# Altium project SC941C.PrjPcb (part 2 of 2)

## Sheet SC941C_STORRM1.SchDoc: Sorties TOR Relais Monostable 1/2
size 393 x 270 mm; CompanyName: Seccom; Address1: 521, rue du capt. François Garbit; Address2: 69440 Mornant; Address3: seccom@seccom.fr; Address4: www.seccom.fr; DocumentNumber: 5; SheetNumber: 5; SheetTotal: 9; PageSetup: Record=PageOptions|CenterHorizontal=True|CenterVertical=True|PrintScale=0.74|XCorrection=1.00|YCorrection=1.00|PrintKind=0|BorderSize=5000000|LeftOffset=0|BottomOffset=0|Orientation=2|PaperLength=1000|PaperWidth=1000|Scale=100|PaperSource=7|PrintQuality=-4|MediaType=1|DitherType=10|PaperKind=A4|PrintScaleMode=1
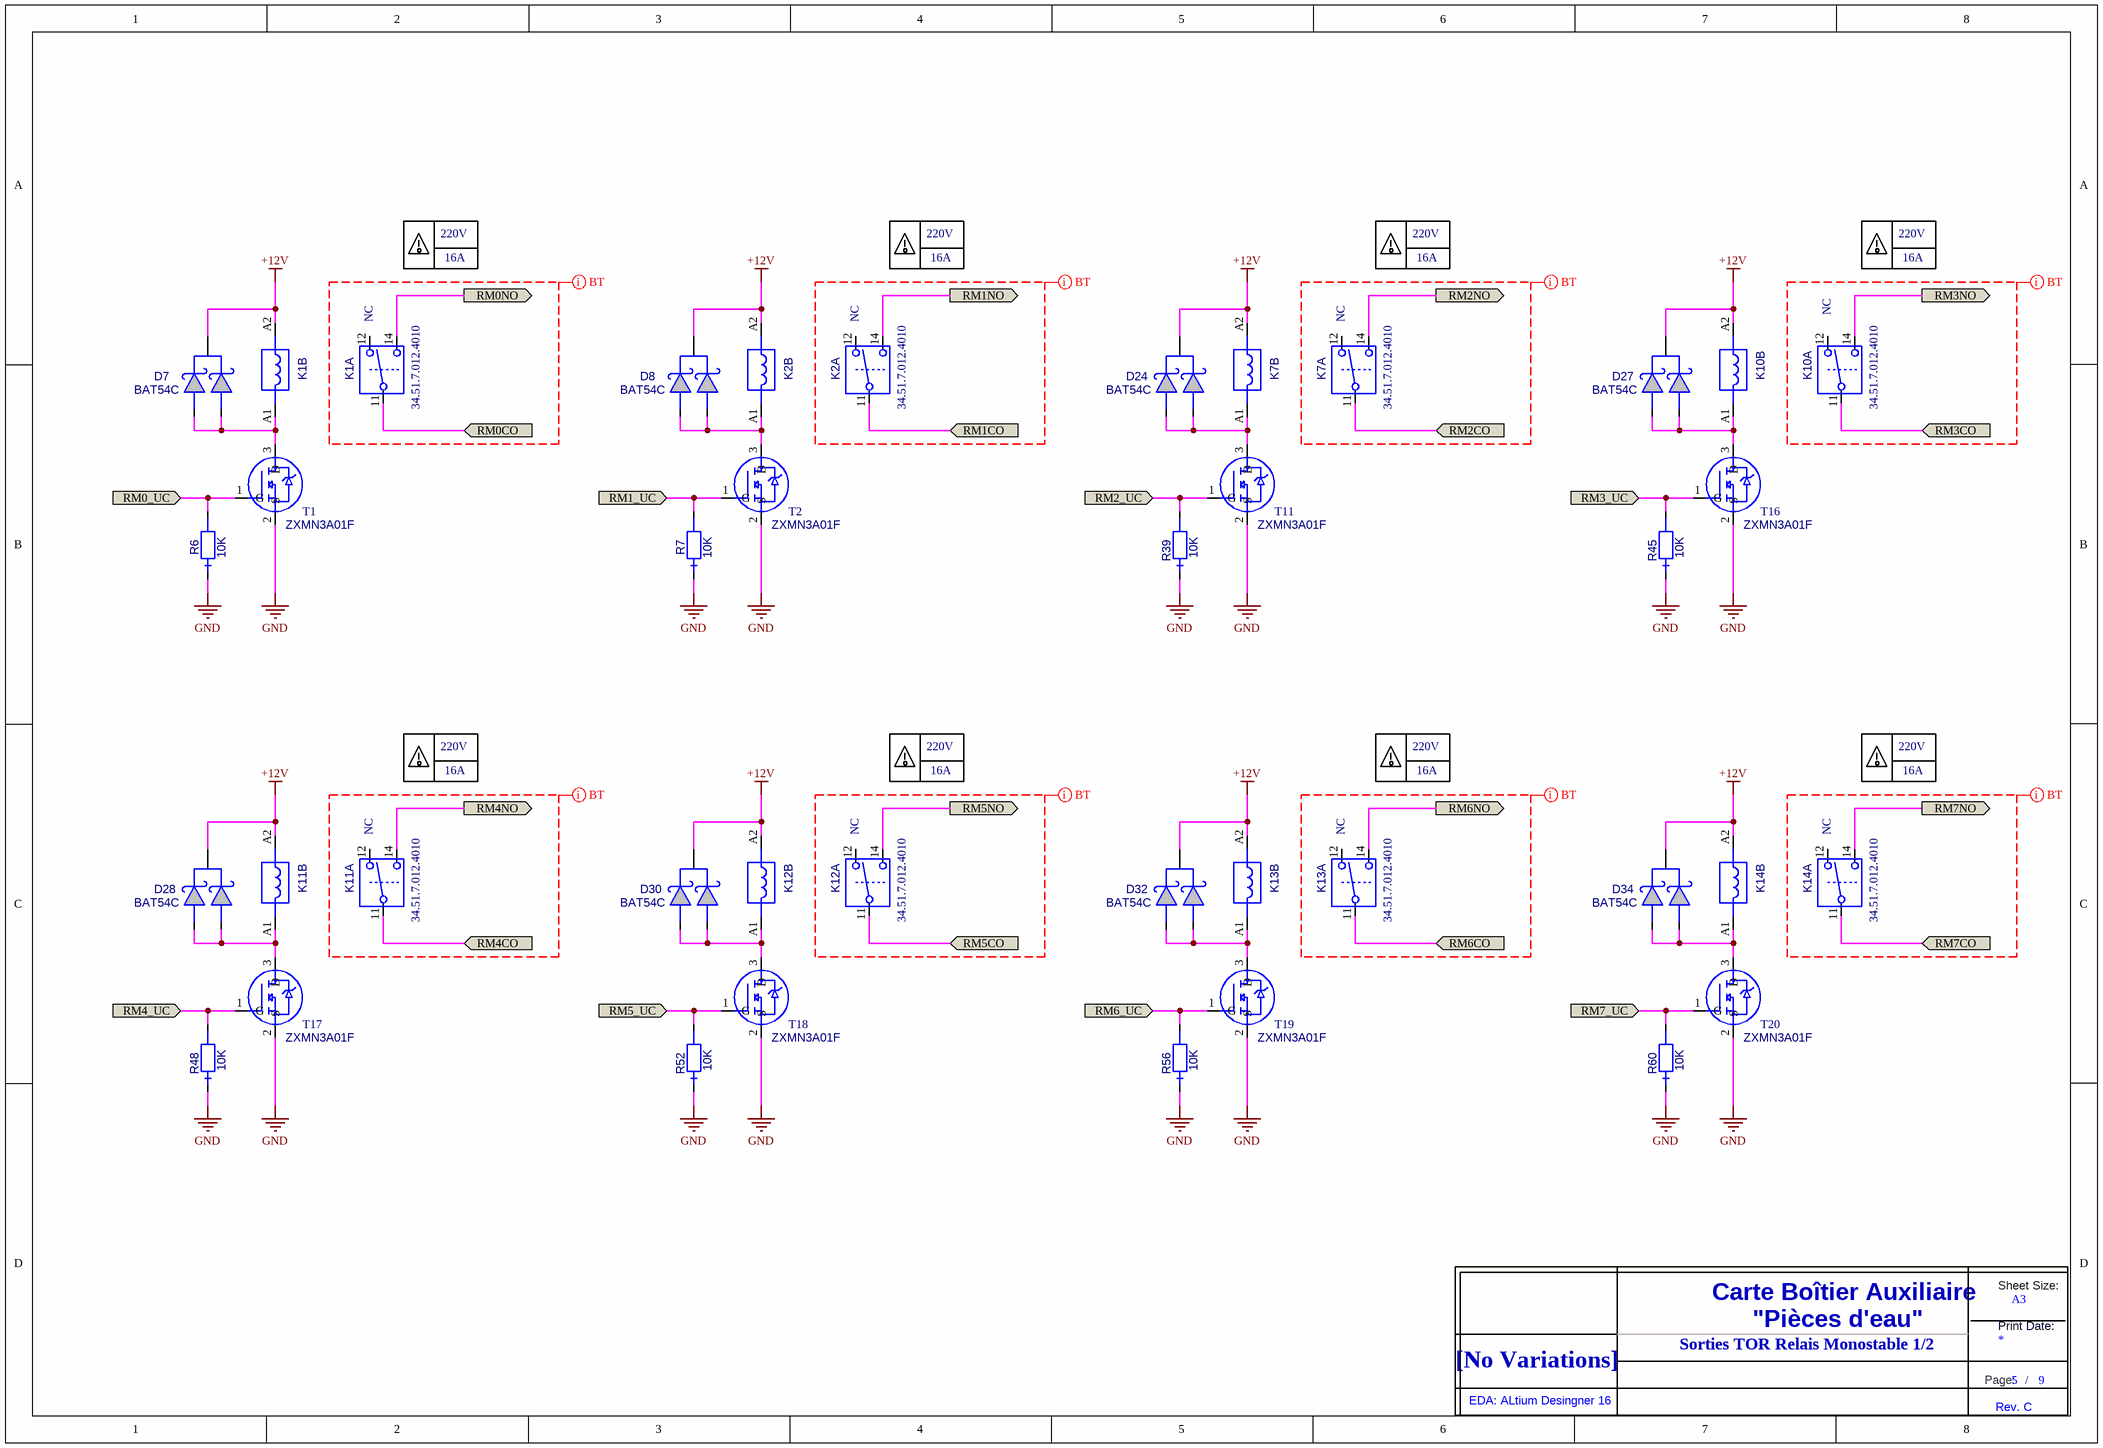
[diagram p5: SC941C_STORRM1.SchDoc]

### Parts
(Parts that share a designator on the sheet are numbered #1, #2 ... from top to bottom, then left to right.)
D7  BAT54C  [SOT23_3L_ReflowSoldering]
D8  BAT54C  [SOT23_3L_ReflowSoldering]
D24  BAT54C  [SOT23_3L_ReflowSoldering]
D27  BAT54C  [SOT23_3L_ReflowSoldering]
D28  BAT54C  [SOT23_3L_ReflowSoldering]
D30  BAT54C  [SOT23_3L_ReflowSoldering]
D32  BAT54C  [SOT23_3L_ReflowSoldering]
D34  BAT54C  [SOT23_3L_ReflowSoldering]
K1  RELAY_12VDC_1RT_34.51  [RELAY_FINDER_34.51_+SUPPORT_93]  (value not drawn)  (parts A,B of 2)
K2  RELAY_12VDC_1RT_34.51  [RELAY_FINDER_34.51_+SUPPORT_93]  (value not drawn)  (parts A,B of 2)
K7  RELAY_12VDC_1RT_34.51  [RELAY_FINDER_34.51_+SUPPORT_93]  (value not drawn)  (parts A,B of 2)
K10  RELAY_12VDC_1RT_34.51  [RELAY_FINDER_34.51_+SUPPORT_93]  (value not drawn)  (parts A,B of 2)
K11  RELAY_12VDC_1RT_34.51  [RELAY_FINDER_34.51_+SUPPORT_93]  (value not drawn)  (parts A,B of 2)
K12  RELAY_12VDC_1RT_34.51  [RELAY_FINDER_34.51_+SUPPORT_93]  (value not drawn)  (parts A,B of 2)
K13  RELAY_12VDC_1RT_34.51  [RELAY_FINDER_34.51_+SUPPORT_93]  (value not drawn)  (parts A,B of 2)
K14  RELAY_12VDC_1RT_34.51  [RELAY_FINDER_34.51_+SUPPORT_93]  (value not drawn)  (parts A,B of 2)
R6  value 10K  [0805_ReflowSoldering_RES]  (hidden comment: RES_0805_1%_100PPM_10K)
R7  value 10K  [0805_ReflowSoldering_RES]  (hidden comment: RES_0805_1%_100PPM_10K)
R39  value 10K  [0805_ReflowSoldering_RES]  (hidden comment: RES_0805_1%_100PPM_10K)
R45  value 10K  [0805_ReflowSoldering_RES]  (hidden comment: RES_0805_1%_100PPM_10K)
R48  value 10K  [0805_ReflowSoldering_RES]  (hidden comment: RES_0805_1%_100PPM_10K)
R52  value 10K  [0805_ReflowSoldering_RES]  (hidden comment: RES_0805_1%_100PPM_10K)
R56  value 10K  [0805_ReflowSoldering_RES]  (hidden comment: RES_0805_1%_100PPM_10K)
R60  value 10K  [0805_ReflowSoldering_RES]  (hidden comment: RES_0805_1%_100PPM_10K)
T1  ZXMN3A01F  [SOT23_3L_ReflowSoldering]
T2  ZXMN3A01F  [SOT23_3L_ReflowSoldering]
T11  ZXMN3A01F  [SOT23_3L_ReflowSoldering]
T16  ZXMN3A01F  [SOT23_3L_ReflowSoldering]
T17  ZXMN3A01F  [SOT23_3L_ReflowSoldering]
T18  ZXMN3A01F  [SOT23_3L_ReflowSoldering]
T19  ZXMN3A01F  [SOT23_3L_ReflowSoldering]
T20  ZXMN3A01F  [SOT23_3L_ReflowSoldering]
Title_new#5  DNI  (value not drawn)  (graphical)

### Ports
RM0_UC (in), RM0CO (in), RM0NO (out), RM1_UC (in), RM1CO (in), RM1NO (out), RM2_UC (in), RM2CO (in), RM2NO (out), RM3_UC (in), RM3CO (in), RM3NO (out), RM4_UC (in), RM4CO (in), RM4NO (out), RM5_UC (in), RM5CO (in), RM5NO (out), RM6_UC (in), RM6CO (in), RM6NO (out), RM7_UC (in), RM7CO (in), RM7NO (out)

### Nets
+12V: D7.3 D8.3 D24.3 D27.3 D28.3 D30.3 D32.3 D34.3 K1.A2 K2.A2 K7.A2 K10.A2 K11.A2 K12.A2 K13.A2 K14.A2
GND: R6.1 R7.1 R39.1 R45.1 R48.1 R52.1 R56.1 R60.1 T1.2(S) T2.2(S) T11.2(S) T16.2(S) T17.2(S) T18.2(S) T19.2(S) T20.2(S)
RM0_UC: R6.2 T1.1(G) ; port RM0_UC
RM0CO: K1.11(COM) K2.11(COM) ; port RM0CO, port RM1CO
RM0NO: K1.14(NO) ; port RM0NO
RM1_UC: R7.2 T2.1(G) ; port RM1_UC
RM1NO: K2.14(NO) ; port RM1NO
RM2_UC: R39.2 T11.1(G) ; port RM2_UC
RM2CO: K7.11(COM) ; port RM2CO
RM2NO: K7.14(NO) ; port RM2NO
RM3_UC: R45.2 T16.1(G) ; port RM3_UC
RM3CO: K10.11(COM) K11.11(COM) ; port RM4CO, port RM3CO
RM3NO: K10.14(NO) ; port RM3NO
RM4_UC: R48.2 T17.1(G) ; port RM4_UC
RM4NO: K11.14(NO) ; port RM4NO
RM5_UC: R52.2 T18.1(G) ; port RM5_UC
RM5CO: K12.11(COM) ; port RM5CO
RM5NO: K12.14(NO) ; port RM5NO
RM6_UC: R56.2 T19.1(G) ; port RM6_UC
RM6CO: K13.11(COM) ; port RM6CO
RM6NO: K13.14(NO) ; port RM6NO
RM7_UC: R60.2 T20.1(G) ; port RM7_UC
RM7CO: K14.11(COM) ; port RM7CO
RM7NO: K14.14(NO) ; port RM7NO
NetD7_1: D7.1 D7.2 K1.A1 T1.3(D)
NetD8_1: D8.1 D8.2 K2.A1 T2.3(D)
NetD24_1: D24.1 D24.2 K7.A1 T11.3(D)
NetD27_1: D27.1 D27.2 K10.A1 T16.3(D)
NetD28_1: D28.1 D28.2 K11.A1 T17.3(D)
NetD30_1: D30.1 D30.2 K12.A1 T18.3(D)
NetD32_1: D32.1 D32.2 K13.A1 T19.3(D)
NetD34_1: D34.1 D34.2 K14.A1 T20.3(D)

Not connected (* = marked no-connect by the designer): K1 12(NC); K2 12(NC); K7 12(NC); K10 12(NC); K11 12(NC); K12 12(NC); K13 12(NC); K14 12(NC)

### Layout directives
net class BT: (no net found under the mark)

### Notes on the sheet
- 220V
- (near K1) NC
- 16A
- (near K2) NC
- (near K7) NC
- (near K10) NC
- (near K11) NC
- (near K12) NC
- (near K13) NC
- (near K14) NC
- Sorties TOR Relais Monostable 1/2
- (in symbol Title_new) Sheet Size:; Carte Boîtier Auxiliaire; A3; "Pièces d'eau"; Print Date:; [No Variations]; Page:; /; EDA: ALtium Desingner 16; Rev. C

### Library data of the parts
D7 D8 D24 D27 D28 D30 D32 D34 = BAT54C: Diode Schottky double, BAT54 cathode com, Vrrm=30V, If=300mA, Vf=0.4Vmax, CMS; Creation: LJ (14/05/02); Reference: 000597/00; Boitier: SOT23_3L; Remarque: {Remarque}; Fabricant: NXP; Coeff: 1; Verification: LJ (14/05/02); Ref Fab: BAT54C; ComponentLink1URL: o:\_Documentation\Datasheets\NXP\BAT54_series.pdf; ComponentLink2URL: o:\_Documentation\Datasheets\_BOITIERS\ACTIF_CMS\SOT\SOT_23_3P_(Schneider).PDF; Config: *; ComponentLink1Description: Datasheet; ComponentLink2Description: Datasheet Boitier; Value: BAT54C; Supplier 1: Farnell; Supplier Part Number 1: 1081192
K1 K2 K7 K10-K14 = RELAY_12VDC_1RT_34.51: Relais 1RT, 12Vdc, série 34.51, Rc=1940R, Sw:250Vac/6A, Ron=? (AgSnO2); Creation: CHD; Verification: LJ (24/11/11); Boitier: DIP12 Form C; Remarque: {Remarque}; Fabricant: Finder; Ref Fab: 34.51.7.012.4010; Coeff: 1; Value: 34.51.7.012.4010; ComponentLink1URL: o:\_Documentation\Datasheets\Finder\Relais_Serie_34.pdf; ComponentLink2URL: o:\_Documentation\Datasheets\_BOITIERS\; Config: *; ComponentLink1Description: Datasheet; ComponentLink2Description: Datasheet Boitier
R6 R7 R39 R45 R48 R52 R56 R60 = RES_0805_1%_100PPM_10K: Résistance CMS 0805, 0.125W, 1%, 100ppm, 150V; Creation: LJ (06/02/09); Reference: 000063/00; Boitier: 0805; Remarque: {Remarque}; Fabricant: Yageo; Ref Fab: RC0805FR-0710KL; Coeff: 1; Verification: *; ComponentLink1URL: o:\_Documentation\Datasheets\BC_Components\Resistances_ThickFilmFlatChip_0402-0603-0805-1206.pdf; ComponentLink2URL: o:\_Documentation\Datasheets\_BOITIERS\PASSIF_CMS\RC_0805_(2x1,25)_(Schneider).PDF; Config: *; ComponentLink1Description: Datasheet; ComponentLink2Description: Datasheet Boitier; Supplier 1: Farnell; Supplier Part Number 1: 9237755
T1 T2 T11 T16-T20 = ZXMN3A01F: Transistor MOSN logique, Vdss=30V, Id=2A, Rdson=0.12R, CMS; Boitier: SOT23_3L; Remarque: {Remarque}; Creation: CHD; Fabricant: Zetex; Coeff: 1; Ref Fab: ZXMN3A01F; ComponentLink1URL: o:\_Documentation\Datasheets\; ComponentLink2URL: o:\_Documentation\Datasheets\_BOITIERS\ACTIF_CMS\SOT\SOT_23_3P_(Schneider).PDF; Config: *; ComponentLink1Description: Datasheet; Value: ZXMN3A01F; Supplier 1: Farnell; Supplier 2: Mouser; Supplier Part Number 1: 9525734; Supplier Part Number 2: 522-ZXMN3A01FTA
Title_new#5 = Title_new

## Sheet SC941C_STORRM2.SchDoc: Sorties TOR Relais Monostable 2/2
size 393 x 270 mm; CompanyName: Seccom; Address1: 521, rue du capt. François Garbit; Address2: 69440 Mornant; Address3: seccom@seccom.fr; Address4: www.seccom.fr; DocumentNumber: 6; SheetNumber: 6; SheetTotal: 9; PageSetup: Record=PageOptions|CenterHorizontal=True|CenterVertical=True|PrintScale=0.74|XCorrection=1.00|YCorrection=1.00|PrintKind=0|BorderSize=5000000|LeftOffset=0|BottomOffset=0|Orientation=2|PaperLength=1000|PaperWidth=1000|Scale=100|PaperSource=7|PrintQuality=-4|MediaType=1|DitherType=10|PaperKind=A4|PrintScaleMode=1
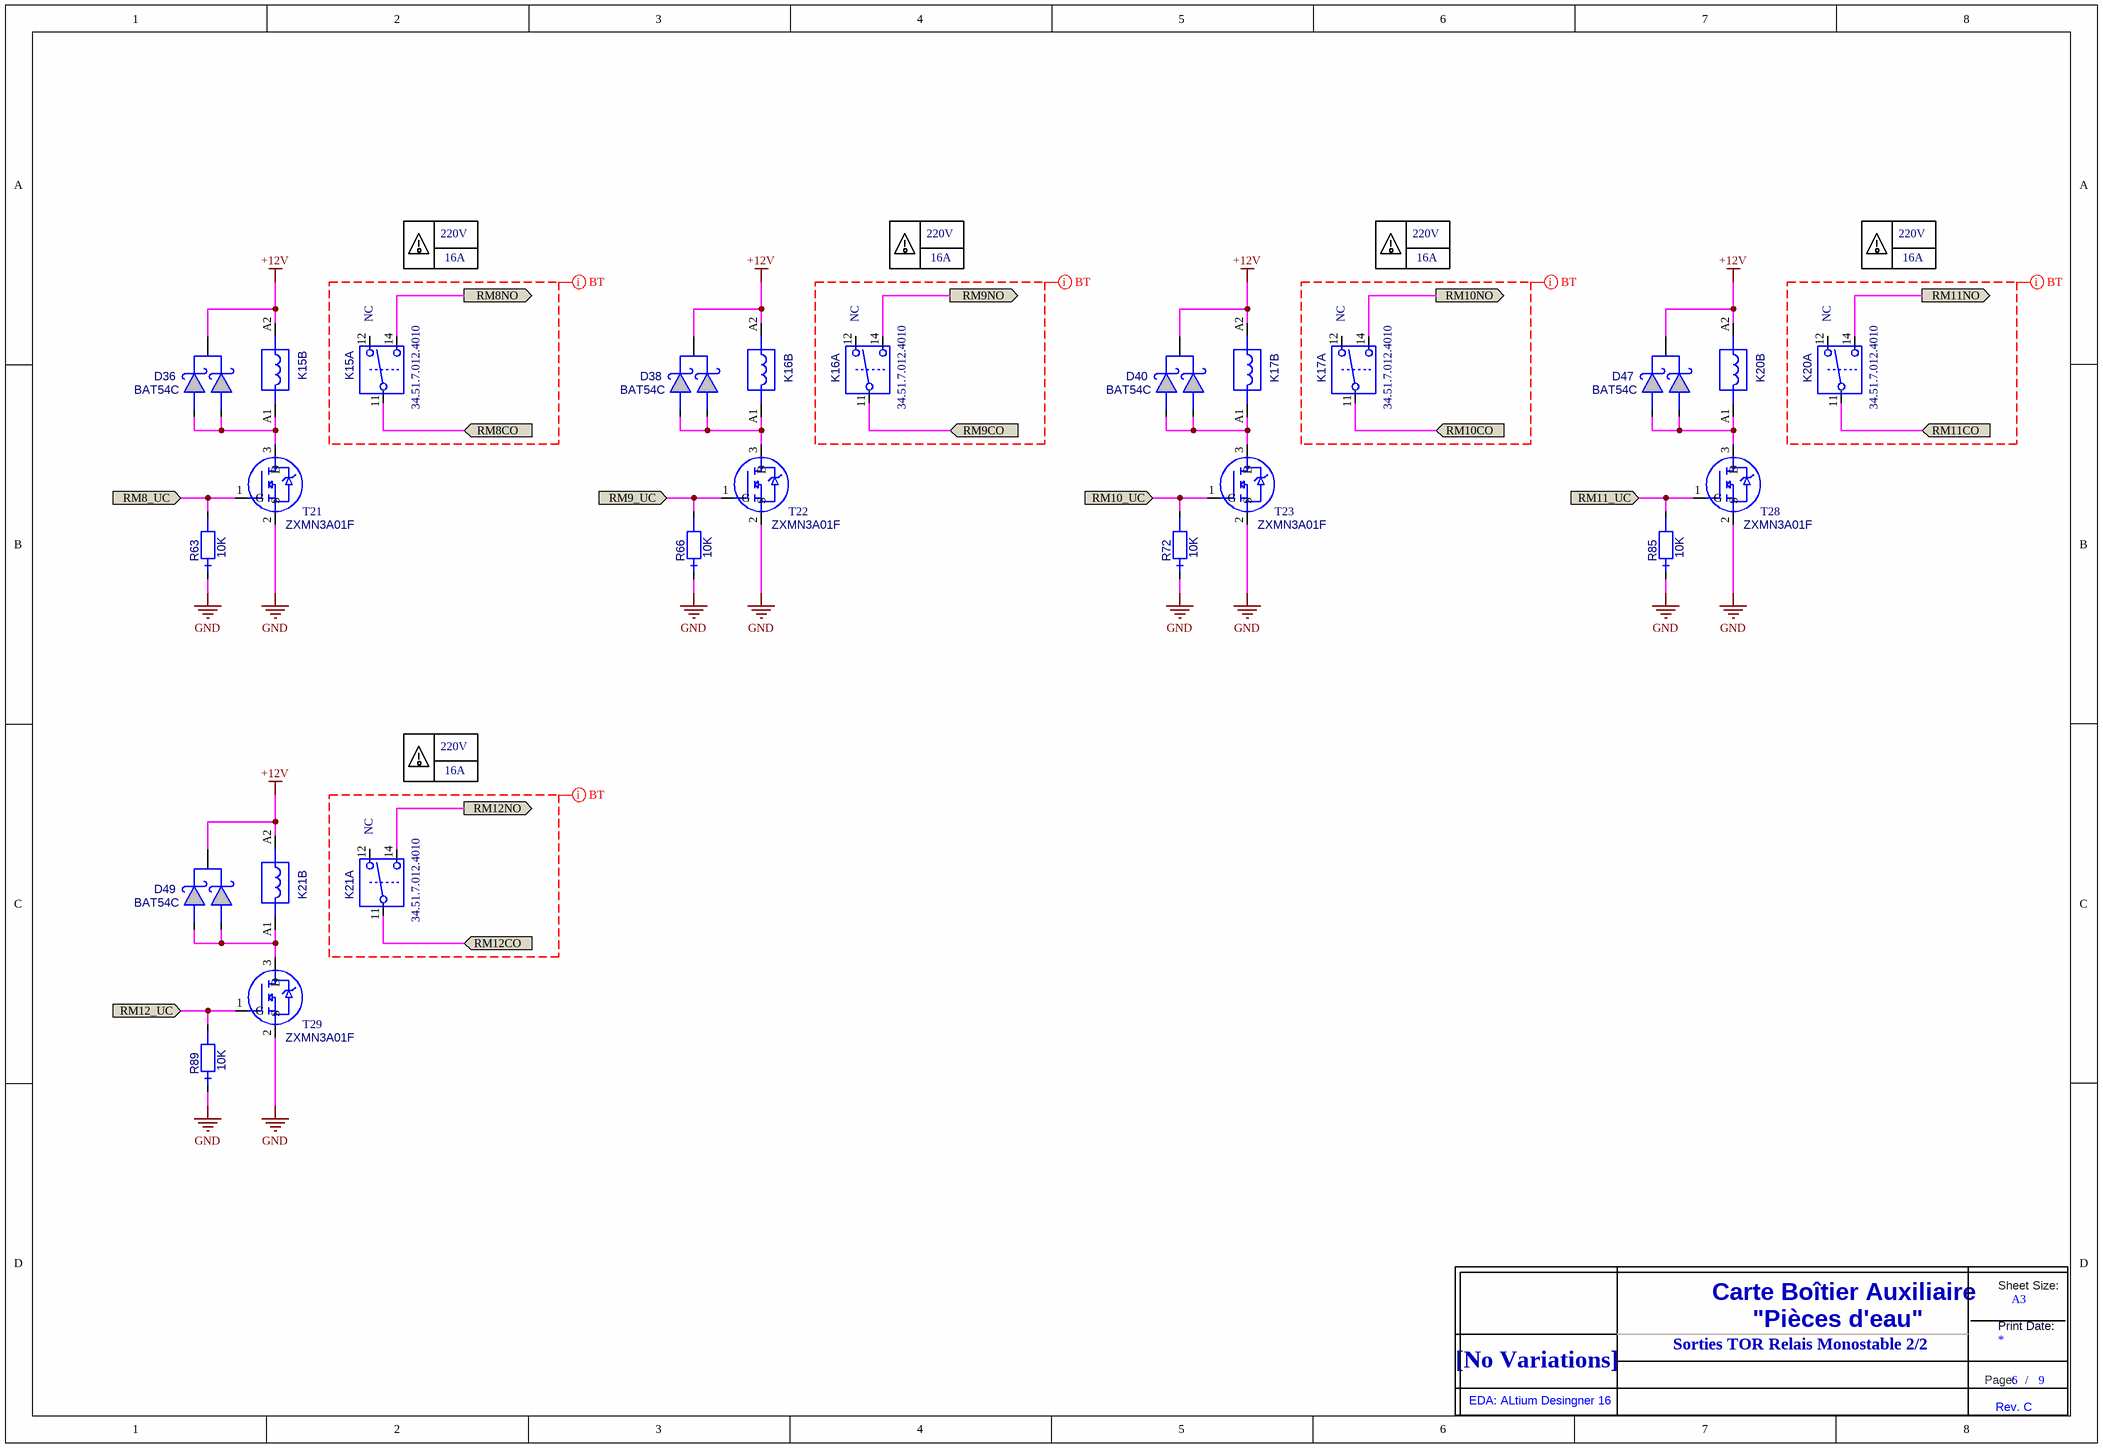
[diagram p6: SC941C_STORRM2.SchDoc]

### Parts
(Parts that share a designator on the sheet are numbered #1, #2 ... from top to bottom, then left to right.)
D36  BAT54C  [SOT23_3L_ReflowSoldering]
D38  BAT54C  [SOT23_3L_ReflowSoldering]
D40  BAT54C  [SOT23_3L_ReflowSoldering]
D47  BAT54C  [SOT23_3L_ReflowSoldering]
D49  BAT54C  [SOT23_3L_ReflowSoldering]
K15  RELAY_12VDC_1RT_34.51  [RELAY_FINDER_34.51_+SUPPORT_93]  (value not drawn)  (parts A,B of 2)
K16  RELAY_12VDC_1RT_34.51  [RELAY_FINDER_34.51_+SUPPORT_93]  (value not drawn)  (parts A,B of 2)
K17  RELAY_12VDC_1RT_34.51  [RELAY_FINDER_34.51_+SUPPORT_93]  (value not drawn)  (parts A,B of 2)
K20  RELAY_12VDC_1RT_34.51  [RELAY_FINDER_34.51_+SUPPORT_93]  (value not drawn)  (parts A,B of 2)
K21  RELAY_12VDC_1RT_34.51  [RELAY_FINDER_34.51_+SUPPORT_93]  (value not drawn)  (parts A,B of 2)
R63  value 10K  [0805_ReflowSoldering_RES]  (hidden comment: RES_0805_1%_100PPM_10K)
R66  value 10K  [0805_ReflowSoldering_RES]  (hidden comment: RES_0805_1%_100PPM_10K)
R72  value 10K  [0805_ReflowSoldering_RES]  (hidden comment: RES_0805_1%_100PPM_10K)
R85  value 10K  [0805_ReflowSoldering_RES]  (hidden comment: RES_0805_1%_100PPM_10K)
R89  value 10K  [0805_ReflowSoldering_RES]  (hidden comment: RES_0805_1%_100PPM_10K)
T21  ZXMN3A01F  [SOT23_3L_ReflowSoldering]
T22  ZXMN3A01F  [SOT23_3L_ReflowSoldering]
T23  ZXMN3A01F  [SOT23_3L_ReflowSoldering]
T28  ZXMN3A01F  [SOT23_3L_ReflowSoldering]
T29  ZXMN3A01F  [SOT23_3L_ReflowSoldering]
Title_new#6  DNI  (value not drawn)  (graphical)

### Ports
RM8_UC (in), RM8CO (in), RM8NO (out), RM9_UC (in), RM9CO (in), RM9NO (out), RM10_UC (in), RM10CO (in), RM10NO (out), RM11_UC (in), RM11CO (in), RM11NO (out), RM12_UC (in), RM12CO (in), RM12NO (out)

### Nets
+12V: D36.3 D38.3 D40.3 D47.3 D49.3 K15.A2 K16.A2 K17.A2 K20.A2 K21.A2
GND: R63.1 R66.1 R72.1 R85.1 R89.1 T21.2(S) T22.2(S) T23.2(S) T28.2(S) T29.2(S)
RM8_UC: R63.2 T21.1(G) ; port RM8_UC
RM8CO: K15.11(COM) ; port RM8CO
RM8NO: K15.14(NO) ; port RM8NO
RM9_UC: R66.2 T22.1(G) ; port RM9_UC
RM9CO: K16.11(COM) ; port RM9CO
RM9NO: K16.14(NO) ; port RM9NO
RM10_UC: R72.2 T23.1(G) ; port RM10_UC
RM10CO: K17.11(COM) ; port RM10CO
RM10NO: K17.14(NO) ; port RM10NO
RM11_UC: R85.2 T28.1(G) ; port RM11_UC
RM11CO: K20.11(COM) K21.11(COM) ; port RM12CO, port RM11CO
RM11NO: K20.14(NO) ; port RM11NO
RM12_UC: R89.2 T29.1(G) ; port RM12_UC
RM12NO: K21.14(NO) ; port RM12NO
NetD36_1: D36.1 D36.2 K15.A1 T21.3(D)
NetD38_1: D38.1 D38.2 K16.A1 T22.3(D)
NetD40_1: D40.1 D40.2 K17.A1 T23.3(D)
NetD47_1: D47.1 D47.2 K20.A1 T28.3(D)
NetD49_1: D49.1 D49.2 K21.A1 T29.3(D)

Not connected (* = marked no-connect by the designer): K15 12(NC); K16 12(NC); K17 12(NC); K20 12(NC); K21 12(NC)

### Layout directives
net class BT: (no net found under the mark)

### Notes on the sheet
- 220V
- (near K15) NC
- 16A
- (near K16) NC
- (near K17) NC
- (near K20) NC
- (near K21) NC
- Sorties TOR Relais Monostable 2/2
- (in symbol Title_new) Sheet Size:; Carte Boîtier Auxiliaire; A3; "Pièces d'eau"; Print Date:; [No Variations]; Page:; /; EDA: ALtium Desingner 16; Rev. C

### Library data of the parts
D36 D38 D40 D47 D49 = BAT54C: as D7 on sheet SC941C_STORRM1; Verification: LJ (14/05/02); Ref Fab: BAT54C; ComponentLink1URL: o:\_Documentation\Datasheets\NXP\BAT54_series.pdf; ComponentLink2URL: o:\_Documentation\Datasheets\_BOITIERS\ACTIF_CMS\SOT\SOT_23_3P_(Schneider).PDF; Config: *; ComponentLink1Description: Datasheet; ComponentLink2Description: Datasheet Boitier; Value: BAT54C; Supplier 1: Farnell; Supplier Part Number 1: 1081192
K15-K17 K20 K21 = RELAY_12VDC_1RT_34.51: as K1 on sheet SC941C_STORRM1; ComponentLink1URL: o:\_Documentation\Datasheets\Finder\Relais_Serie_34.pdf; ComponentLink2URL: o:\_Documentation\Datasheets\_BOITIERS\; Config: *; ComponentLink1Description: Datasheet; ComponentLink2Description: Datasheet Boitier
R63 R66 R72 R85 R89 = RES_0805_1%_100PPM_10K: as R6 on sheet SC941C_STORRM1; Verification: *; ComponentLink1URL: o:\_Documentation\Datasheets\BC_Components\Resistances_ThickFilmFlatChip_0402-0603-0805-1206.pdf; ComponentLink2URL: o:\_Documentation\Datasheets\_BOITIERS\PASSIF_CMS\RC_0805_(2x1,25)_(Schneider).PDF; Config: *; ComponentLink1Description: Datasheet; ComponentLink2Description: Datasheet Boitier; Supplier 1: Farnell; Supplier Part Number 1: 9237755
T21-T23 T28 T29 = ZXMN3A01F: as T1 on sheet SC941C_STORRM1; Ref Fab: ZXMN3A01F; ComponentLink1URL: o:\_Documentation\Datasheets\; ComponentLink2URL: o:\_Documentation\Datasheets\_BOITIERS\ACTIF_CMS\SOT\SOT_23_3P_(Schneider).PDF; Config: *; ComponentLink1Description: Datasheet; Value: ZXMN3A01F; Supplier 1: Farnell; Supplier 2: Mouser; Supplier Part Number 1: 9525734; Supplier Part Number 2: 522-ZXMN3A01FTA
Title_new#6 = Title_new

## Sheet SC941C_Variateurs.SchDoc: Variateurs
size 393 x 270 mm; CompanyName: Seccom; Address1: 521, rue du capt. François Garbit; Address2: 69440 Mornant; Address3: seccom@seccom.fr; Address4: www.seccom.fr; DocumentNumber: 7; SheetNumber: 7; SheetTotal: 9; PageSetup: Record=PageOptions|CenterHorizontal=True|CenterVertical=True|PrintScale=0.74|XCorrection=1.00|YCorrection=1.00|PrintKind=0|BorderSize=5000000|LeftOffset=0|BottomOffset=0|Orientation=2|PaperLength=1000|PaperWidth=1000|Scale=100|PaperSource=7|PrintQuality=-4|MediaType=1|DitherType=10|PaperKind=A4|PrintScaleMode=1
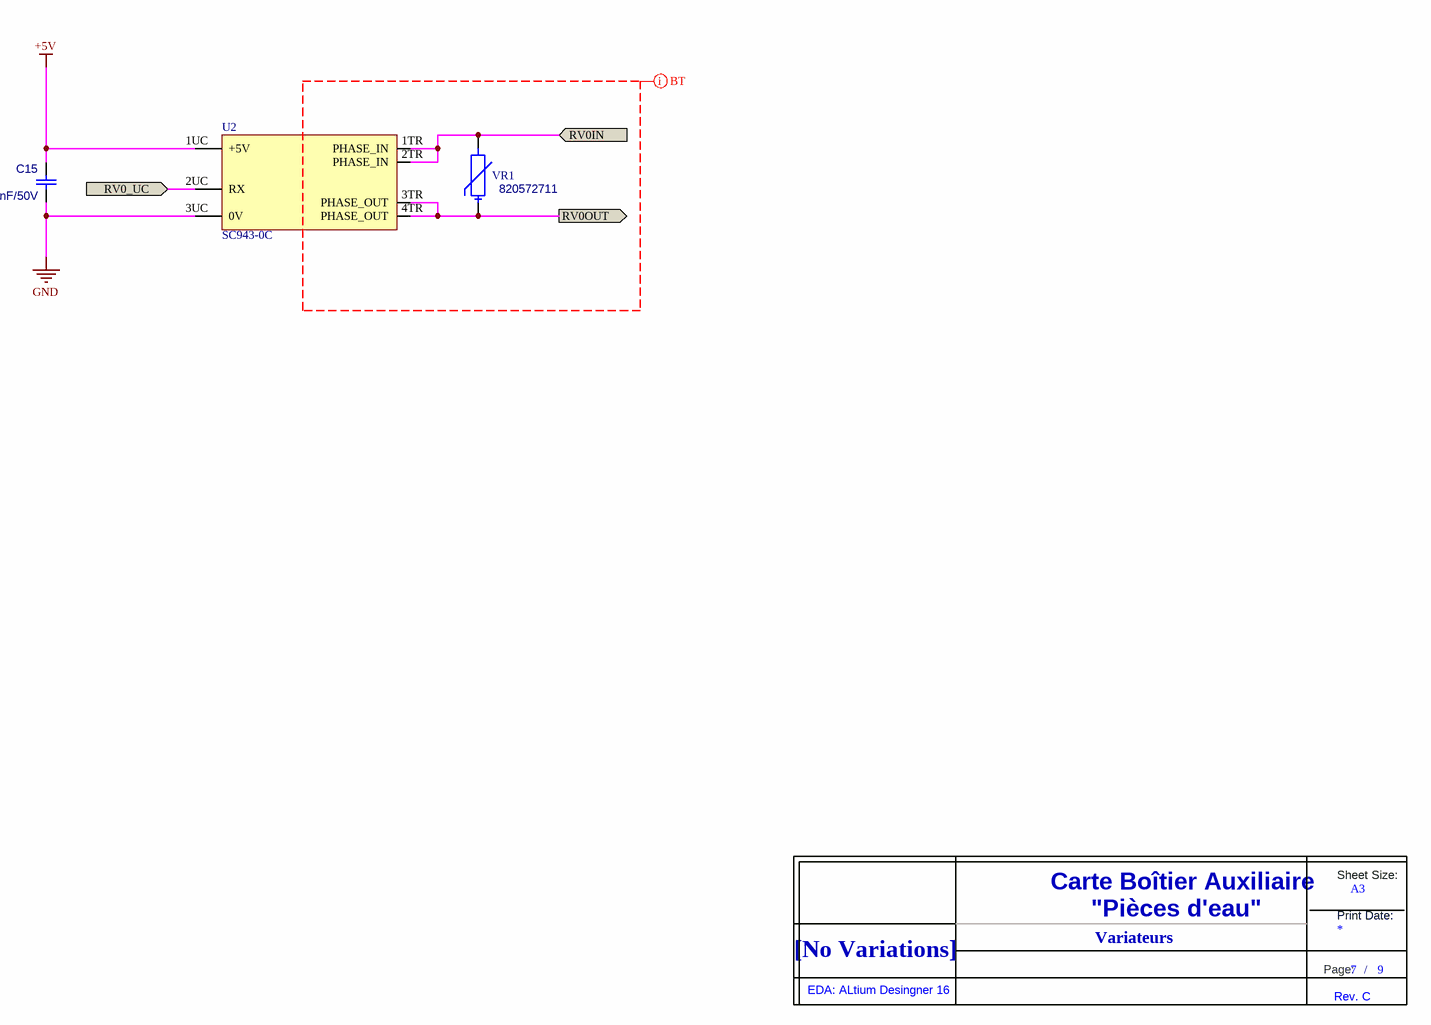
[diagram p7: SC941C_Variateurs.SchDoc]

### Parts
(Parts that share a designator on the sheet are numbered #1, #2 ... from top to bottom, then left to right.)
C15  value 100nF/50V  [0805_ReflowSoldering_CAP]  (hidden comment: C_0805_X7R_10%_100N-50V)
Title_new#7  DNI  (value not drawn)  (graphical)
U2  SC943-0C  [SI943C_REV_A]
VR1  value 820572711  [VDR_Serie_820_d7_h13_e5mm]  (hidden comment: VDR_820572711)

### Ports
RV0_UC (in), RV0IN (in), RV0OUT (out)

### Nets
+5V: C15.1 U2.1UC(+5V)
GND: C15.2 U2.3UC(0V)
RV0_UC: U2.2UC(RX) ; port RV0_UC
RV0IN: U2.1TR(PHASE_IN) U2.2TR(PHASE_IN) VR1.2 ; port RV0IN
RV0OUT: U2.3TR(PHASE_OUT) U2.4TR(PHASE_OUT) VR1.1 ; port RV0OUT

### Layout directives
net class BT: (no net found under the mark)

### Notes on the sheet
- Variateurs
- (in symbol Title_new) Sheet Size:; Carte Boîtier Auxiliaire; A3; "Pièces d'eau"; Print Date:; [No Variations]; Page:; /; EDA: ALtium Desingner 16; Rev. C

### Library data of the parts
C15 = C_0805_X7R_10%_100N-50V: Condensateur céramique, X7R, 10%, CMS 0805; Creation: LJ; Verification: LJ (28/05/04); Reference: 000042/00; Boitier: 0805; Remarque: {Remarque}; Fabricant: AVX; Ref Fab: 08055C104KAT2A; Coeff: 1; ComponentLink1URL: o:\_Documentation\Datasheets\BC_Components\Condo_CMS_NPO-X7R-Y5V.pdf; ComponentLink2URL: o:\_Documentation\Datasheets\_BOITIERS\PASSIF_CMS\RC_0805_(2x1,25)_(Schneider).PDF; Config: *; ComponentLink1Description: Datasheet; ComponentLink2Description: Datasheet Boitier; Supplier 1: Farnell; Supplier Part Number 1: 499687
Title_new#7 = Title_new
U2 = SC943-0C: Carte gradateur; Boitier: SI943C; Coeff: 1; Fabricant: Valentinéa; Remarque: {Remarque}; Ref Fab: SC943-0C; Value: SC943-0C
VR1 = VDR_820572711: Varistance disque 275Vac, 350Vdc, 33J, Vbreak=430V@1mA, Vclamp=710V@10A, Ipeak=1200A; Creation: LJ (12/01/12); Reference: {Reference}; Boitier: d7_t4.6_h13_e5mm; Remarque: {Remarque}; Fabricant: Wurth Elektronik; Coeff: 1; Ref Fab: 820572711; ComponentLink1URL: o:\_Documentation\Datasheets\Wurth_Elektronik\Varistance_820572711.pdf; ComponentLink2URL: o:\_Documentation\Datasheets\; Config: *; ComponentLink1Description: Datasheet; ComponentLink2Description: Datasheet Boitier

## Sheet SC941C_STORRB.SchDoc: Sorties TOR Relais Bistable
size 393 x 270 mm; CompanyName: Seccom; Address1: 521, rue du capt. François Garbit; Address2: 69440 Mornant; Address3: seccom@seccom.fr; Address4: www.seccom.fr; DocumentNumber: 8; SheetNumber: 8; SheetTotal: 9; PageSetup: Record=PageOptions|CenterHorizontal=True|CenterVertical=True|PrintScale=0.74|XCorrection=1.00|YCorrection=1.00|PrintKind=0|BorderSize=5000000|LeftOffset=0|BottomOffset=0|Orientation=2|PaperLength=1000|PaperWidth=1000|Scale=100|PaperSource=7|PrintQuality=-4|MediaType=1|DitherType=10|PaperKind=A4|PrintScaleMode=1
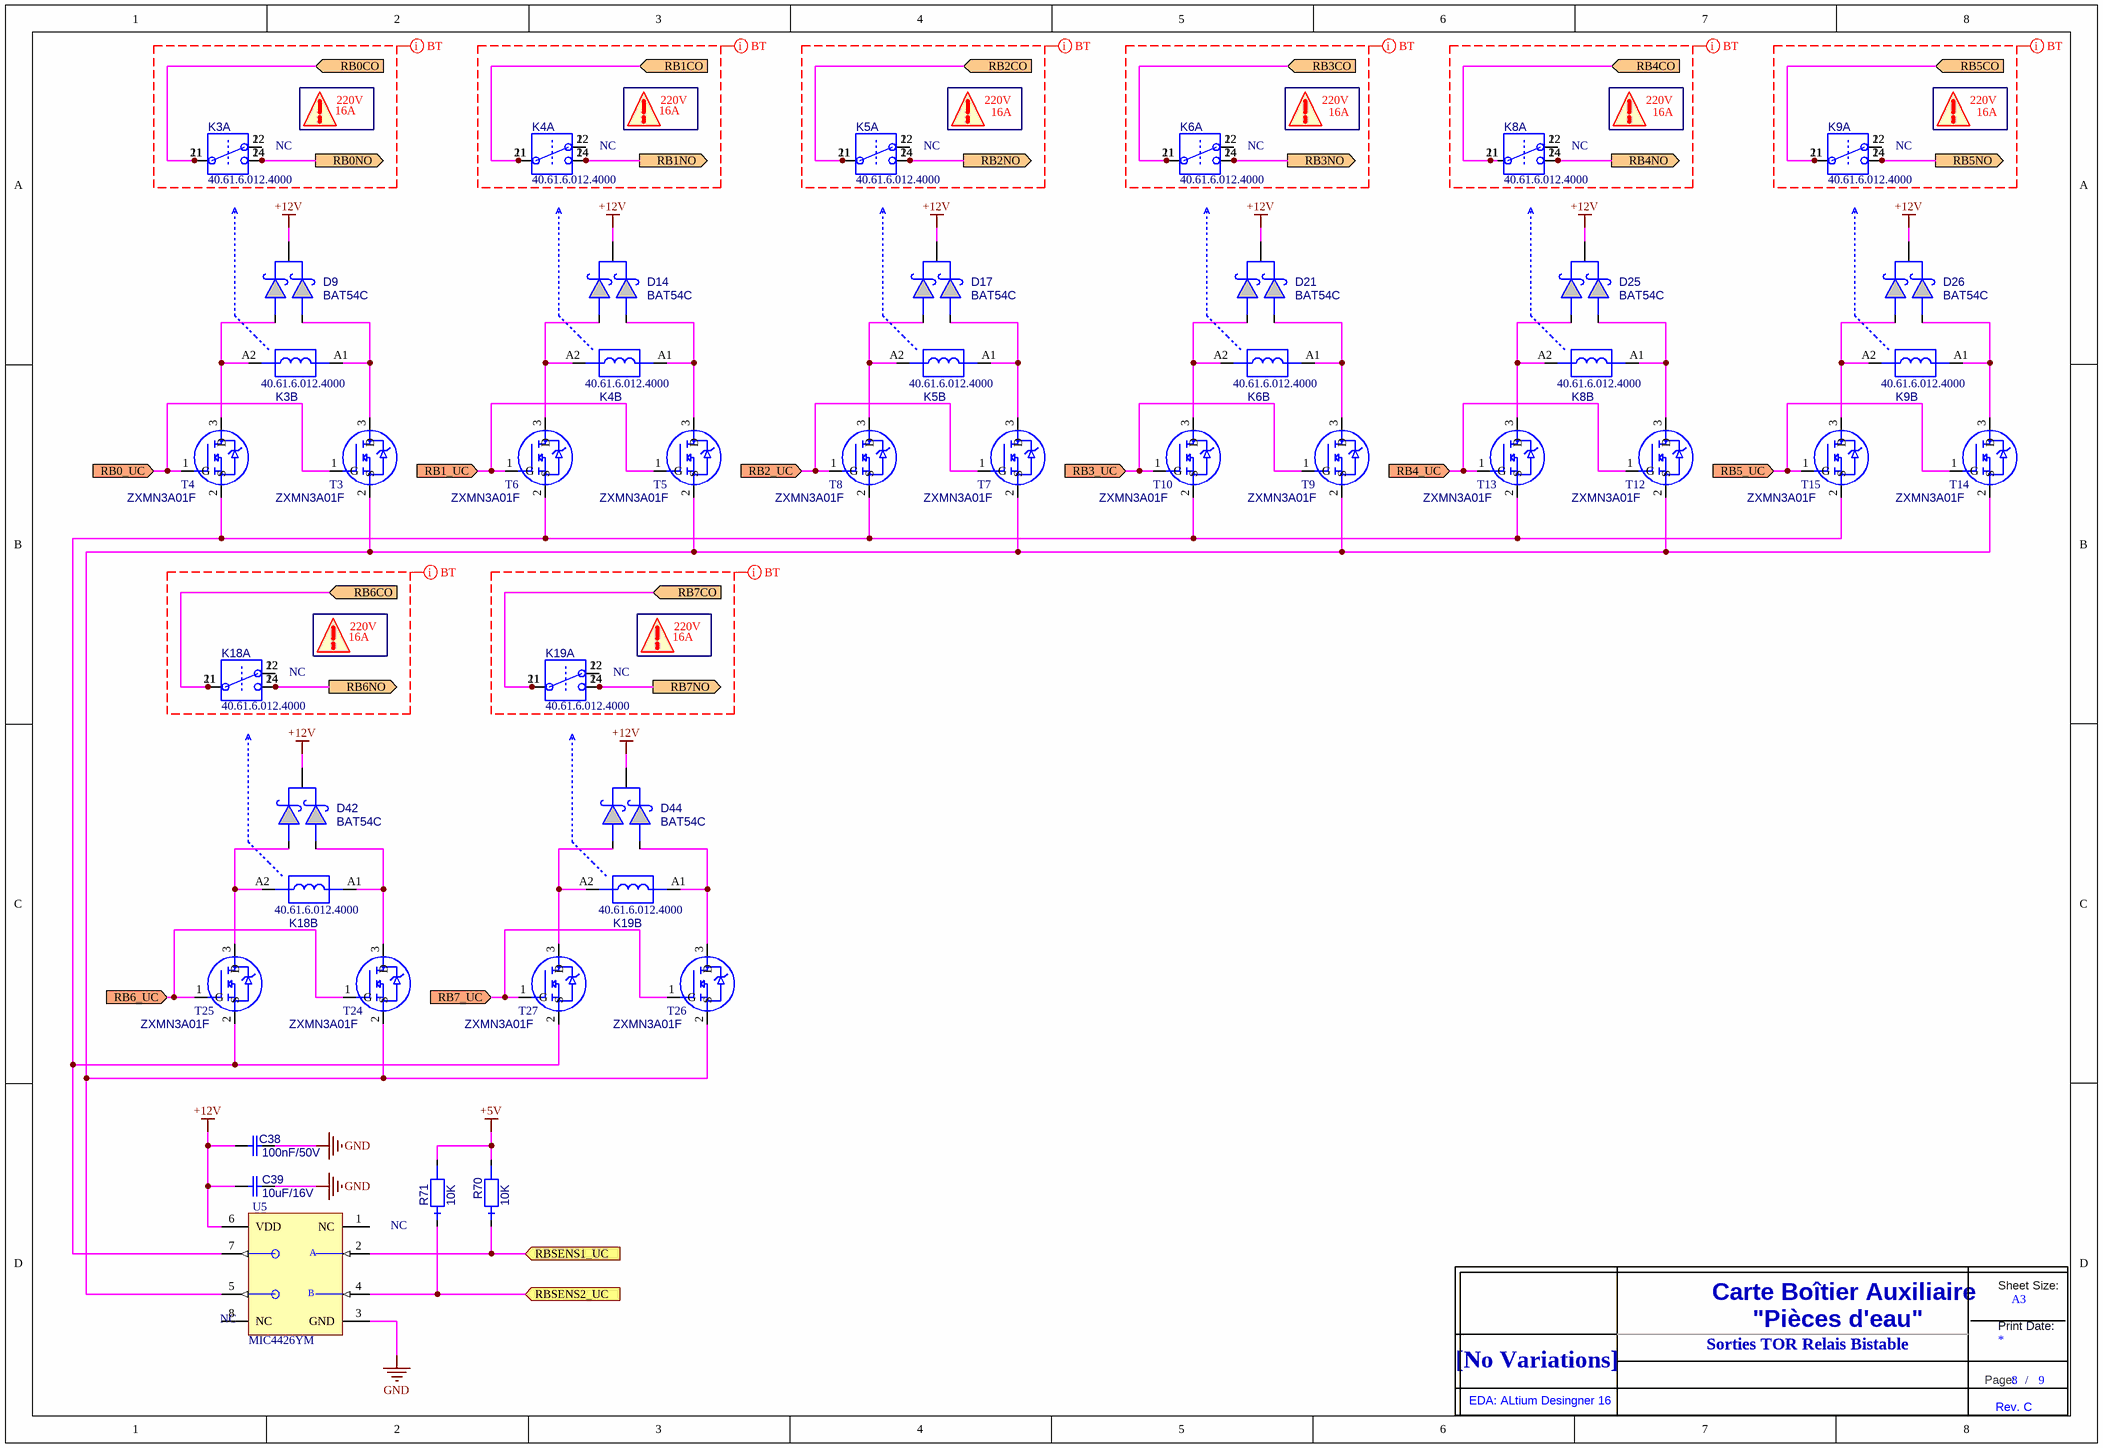
[diagram p8: SC941C_STORRB.SchDoc]

### Parts
(Parts that share a designator on the sheet are numbered #1, #2 ... from top to bottom, then left to right.)
C38  value 100nF/50V  [0805_ReflowSoldering_CAP]  (hidden comment: C_0805_X7R_10%_100N-50V)
C39  value 10uF/16V  [0805_ReflowSoldering_CAP]  (hidden comment: C_0805_X5R_10%_10U-16V)
D9  BAT54C  [SOT23_3L_ReflowSoldering]
D14  BAT54C  [SOT23_3L_ReflowSoldering]
D17  BAT54C  [SOT23_3L_ReflowSoldering]
D21  BAT54C  [SOT23_3L_ReflowSoldering]
D25  BAT54C  [SOT23_3L_ReflowSoldering]
D26  BAT54C  [SOT23_3L_ReflowSoldering]
D42  BAT54C  [SOT23_3L_ReflowSoldering]
D44  BAT54C  [SOT23_3L_ReflowSoldering]
K3  value 40.61.6.012.4000  [RELAY_FINDER_40.61_+SUPPORT_95]  (hidden comment: RELAY_12VDC_1RT_BI_40.61.6)  (parts A,B of 2)
K4  value 40.61.6.012.4000  [RELAY_FINDER_40.61_+SUPPORT_95]  (hidden comment: RELAY_12VDC_1RT_BI_40.61.6)  (parts A,B of 2)
K5  value 40.61.6.012.4000  [RELAY_FINDER_40.61_+SUPPORT_95]  (hidden comment: RELAY_12VDC_1RT_BI_40.61.6)  (parts A,B of 2)
K6  value 40.61.6.012.4000  [RELAY_FINDER_40.61_+SUPPORT_95]  (hidden comment: RELAY_12VDC_1RT_BI_40.61.6)  (parts A,B of 2)
K8  value 40.61.6.012.4000  [RELAY_FINDER_40.61_+SUPPORT_95]  (hidden comment: RELAY_12VDC_1RT_BI_40.61.6)  (parts A,B of 2)
K9  value 40.61.6.012.4000  [RELAY_FINDER_40.61_+SUPPORT_95]  (hidden comment: RELAY_12VDC_1RT_BI_40.61.6)  (parts A,B of 2)
K18  value 40.61.6.012.4000  [RELAY_FINDER_40.61_+SUPPORT_95]  (hidden comment: RELAY_12VDC_1RT_BI_40.61.6)  (parts A,B of 2)
K19  value 40.61.6.012.4000  [RELAY_FINDER_40.61_+SUPPORT_95]  (hidden comment: RELAY_12VDC_1RT_BI_40.61.6)  (parts A,B of 2)
R70  value 10K  [0805_ReflowSoldering_RES]  (hidden comment: RES_0805_1%_100PPM_10K)
R71  value 10K  [0805_ReflowSoldering_RES]  (hidden comment: RES_0805_1%_100PPM_10K)
T3  ZXMN3A01F  [SOT23_3L_ReflowSoldering]
T4  ZXMN3A01F  [SOT23_3L_ReflowSoldering]
T5  ZXMN3A01F  [SOT23_3L_ReflowSoldering]
T6  ZXMN3A01F  [SOT23_3L_ReflowSoldering]
T7  ZXMN3A01F  [SOT23_3L_ReflowSoldering]
T8  ZXMN3A01F  [SOT23_3L_ReflowSoldering]
T9  ZXMN3A01F  [SOT23_3L_ReflowSoldering]
T10  ZXMN3A01F  [SOT23_3L_ReflowSoldering]
T12  ZXMN3A01F  [SOT23_3L_ReflowSoldering]
T13  ZXMN3A01F  [SOT23_3L_ReflowSoldering]
T14  ZXMN3A01F  [SOT23_3L_ReflowSoldering]
T15  ZXMN3A01F  [SOT23_3L_ReflowSoldering]
T24  ZXMN3A01F  [SOT23_3L_ReflowSoldering]
T25  ZXMN3A01F  [SOT23_3L_ReflowSoldering]
T26  ZXMN3A01F  [SOT23_3L_ReflowSoldering]
T27  ZXMN3A01F  [SOT23_3L_ReflowSoldering]
Title_new#8  DNI  (value not drawn)  (graphical)
U5  MIC4426YM  [SOIC_08_E1,27_L150_ReflowSoldering]

### Ports
RB0_UC (in), RB0CO (in), RB0NO (out), RB1_UC (in), RB1CO (in), RB1NO (out), RB2_UC (in), RB2CO (in), RB2NO (out), RB3_UC (in), RB3CO (in), RB3NO (out), RB4_UC (in), RB4CO (in), RB4NO (out), RB5_UC (in), RB5CO (in), RB5NO (out), RB6_UC (in), RB6CO (in), RB6NO (out), RB7_UC (in), RB7CO (in), RB7NO (out), RBSENS1_UC (in), RBSENS2_UC (in)

### Nets
+5V: R70.2 R71.2
+12V: C38.1 C39.2 D9.3 D14.3 D17.3 D21.3 D25.3 D26.3 D42.3 D44.3 U5.6(VDD)
GND: C38.2 C39.1 U5.3(GND)
RB0_UC: T3.1(G) T4.1(G) ; port RB0_UC
RB0CO: K3.11(COM) K3.21(COM) K4.11(COM) K4.21(COM) K5.11(COM) K5.21(COM) K6.11(COM) K6.21(COM) ; port RB0CO, port RB1CO, port RB2CO, port RB3CO
RB0NO: K3.14(NO) K3.24(NO) ; port RB0NO
RB1_UC: T5.1(G) T6.1(G) ; port RB1_UC
RB1NO: K4.14(NO) K4.24(NO) ; port RB1NO
RB2_UC: T7.1(G) T8.1(G) ; port RB2_UC
RB2NO: K5.14(NO) K5.24(NO) ; port RB2NO
RB3_UC: T9.1(G) T10.1(G) ; port RB3_UC
RB3NO: K6.14(NO) K6.24(NO) ; port RB3NO
RB4_UC: T12.1(G) T13.1(G) ; port RB4_UC
RB4CO: K8.11(COM) K8.21(COM) K9.11(COM) K9.21(COM) ; port RB4CO, port RB5CO
RB4NO: K8.14(NO) K8.24(NO) ; port RB4NO
RB5_UC: T14.1(G) T15.1(G) ; port RB5_UC
RB5NO: K9.14(NO) K9.24(NO) ; port RB5NO
RB6_UC: T24.1(G) T25.1(G) ; port RB6_UC
RB6CO: K18.11(COM) K18.21(COM) K19.11(COM) K19.21(COM) ; port RB6CO, port RB7CO
RB6NO: K18.14(NO) K18.24(NO) ; port RB6NO
RB7_UC: T26.1(G) T27.1(G) ; port RB7_UC
RB7NO: K19.14(NO) K19.24(NO) ; port RB7NO
RBSENS1_UC: R70.1 U5.2(INA) ; port RBSENS1_UC
RBSENS2_UC: R71.1 U5.4(INB) ; port RBSENS2_UC
NetD9_1: D9.1 K3.A1 T3.3(D)
NetD9_2: D9.2 K3.A2 T4.3(D)
NetD14_1: D14.1 K4.A1 T5.3(D)
NetD14_2: D14.2 K4.A2 T6.3(D)
NetD17_1: D17.1 K5.A1 T7.3(D)
NetD17_2: D17.2 K5.A2 T8.3(D)
NetD21_1: D21.1 K6.A1 T9.3(D)
NetD21_2: D21.2 K6.A2 T10.3(D)
NetD25_1: D25.1 K8.A1 T12.3(D)
NetD25_2: D25.2 K8.A2 T13.3(D)
NetD26_1: D26.1 K9.A1 T14.3(D)
NetD26_2: D26.2 K9.A2 T15.3(D)
NetD42_1: D42.1 K18.A1 T24.3(D)
NetD42_2: D42.2 K18.A2 T25.3(D)
NetD44_1: D44.1 K19.A1 T26.3(D)
NetD44_2: D44.2 K19.A2 T27.3(D)
NetK3_12: K3.12(NC) K3.22(NC)
NetK4_12: K4.12(NC) K4.22(NC)
NetK5_12: K5.12(NC) K5.22(NC)
NetK6_12: K6.12(NC) K6.22(NC)
NetK8_12: K8.12(NC) K8.22(NC)
NetK9_12: K9.12(NC) K9.22(NC)
NetK18_12: K18.12(NC) K18.22(NC)
NetK19_12: K19.12(NC) K19.22(NC)
NetT3_2: T3.2(S) T5.2(S) T7.2(S) T9.2(S) T12.2(S) T14.2(S) T24.2(S) T26.2(S) U5.5(~{OUTB})
NetT4_2: T4.2(S) T6.2(S) T8.2(S) T10.2(S) T13.2(S) T15.2(S) T25.2(S) T27.2(S) U5.7(~{OUTA})

Not connected (* = marked no-connect by the designer): U5 1(NC) 8(NC)

### Layout directives
net class BT: (no net found under the mark)

### Notes on the sheet
- 16A
- 220V
- (near K3) NC
- (near K4) NC
- (near K5) NC
- (near K6) NC
- (near K8) NC
- (near K9) NC
- (near K18) NC
- (near K19) NC
- NC
- (near U5) NC
- Sorties TOR Relais Bistable
- (in symbol MIC4426YM) A; B
- (in symbol Title_new) Sheet Size:; Carte Boîtier Auxiliaire; A3; "Pièces d'eau"; Print Date:; [No Variations]; Page:; /; EDA: ALtium Desingner 16; Rev. C

### Library data of the parts
C38 = C_0805_X7R_10%_100N-50V: as C15 on sheet SC941C_Variateurs; ComponentLink1URL: o:\_Documentation\Datasheets\BC_Components\Condo_CMS_NPO-X7R-Y5V.pdf; ComponentLink2URL: o:\_Documentation\Datasheets\_BOITIERS\PASSIF_CMS\RC_0805_(2x1,25)_(Schneider).PDF; Config: *; ComponentLink1Description: Datasheet; ComponentLink2Description: Datasheet Boitier; Supplier 1: Farnell; Supplier Part Number 1: 499687
C39 = C_0805_X5R_10%_10U-16V: Condensateur céramique, X5R, 10%, CMS 0805; Creation: LJ (12/09/11); Reference: 001715/00; Boitier: 0805; Remarque: {Remarque}; Coeff: 1; Fabricant: Murata; Ref Fab: GRM219R61C106KA73D; Verification: *; ComponentLink1URL: o:\_Documentation\Datasheets\; ComponentLink2URL: o:\_Documentation\Datasheets\_Boitiers\PASSIF_CMS\RC_0805_(2x1,25)_(Schneider).pdf; Config: *; ComponentLink1Description: Datasheet; ComponentLink2Description: Datasheet Boitier
D9 D14 D17 D21 D25 D26 D42 D44 = BAT54C: as D7 on sheet SC941C_STORRM1; Verification: LJ (14/05/02); Ref Fab: BAT54C; ComponentLink1URL: o:\_Documentation\Datasheets\NXP\BAT54_series.pdf; ComponentLink2URL: o:\_Documentation\Datasheets\_BOITIERS\ACTIF_CMS\SOT\SOT_23_3P_(Schneider).PDF; Config: *; ComponentLink1Description: Datasheet; ComponentLink2Description: Datasheet Boitier; Value: BAT54C; Supplier 1: Farnell; Supplier Part Number 1: 1081192
K3-K6 K8 K9 K18 K19 = RELAY_12VDC_1RT_BI_40.61.6: Relais 1RT, 12Vdc, série 40.61.6 (bistable), Rc=900R, Sw:250Vac/16A, Ron=? (AgSnO2); Creation: CHD; Verification: LJ (24/11/11); Boitier: type DIP16; Remarque: {Remarque}; Fabricant: Finder; Coeff: 1; Ref Fab: 40.61.6.012.4000; ComponentLink1URL: o:\_Documentation\Datasheets\Finder\Relais_Serie_40.pdf; ComponentLink2URL: o:\_Documentation\Datasheets\_BOITIERS\; Config: *; ComponentLink1Description: Datasheet; ComponentLink2Description: Datasheet Boitier
R70 R71 = RES_0805_1%_100PPM_10K: as R6 on sheet SC941C_STORRM1; Verification: *; ComponentLink1URL: o:\_Documentation\Datasheets\BC_Components\Resistances_ThickFilmFlatChip_0402-0603-0805-1206.pdf; ComponentLink2URL: o:\_Documentation\Datasheets\_BOITIERS\PASSIF_CMS\RC_0805_(2x1,25)_(Schneider).PDF; Config: *; ComponentLink1Description: Datasheet; ComponentLink2Description: Datasheet Boitier; Supplier 1: Farnell; Supplier Part Number 1: 9237755
T3-T10 T12-T15 T24-T27 = ZXMN3A01F: as T1 on sheet SC941C_STORRM1; Ref Fab: ZXMN3A01F; ComponentLink1URL: o:\_Documentation\Datasheets\; ComponentLink2URL: o:\_Documentation\Datasheets\_BOITIERS\ACTIF_CMS\SOT\SOT_23_3P_(Schneider).PDF; Config: *; ComponentLink1Description: Datasheet; Value: ZXMN3A01F; Supplier 1: Farnell; Supplier 2: Mouser; Supplier Part Number 1: 9525734; Supplier Part Number 2: 522-ZXMN3A01FTA
Title_new#8 = Title_new
U5 = MIC4426YM: Dual High-Speed 1.5A MOSFET Driver, CMS; Creation: CHD; Verification: LJ (); Boitier: SO8_L150; Remarque: {Remarque}; Fabricant: Micrel; Coeff: 1; Ref Fab: MIC4426YM; ComponentLink1URL: o:\_Documentation\Datasheets\; ComponentLink2URL: o:\_Documentation\Datasheets\_Boitiers\ACTIF_CMS\SOIC\SOIC_08_e1,27_L150_(Schneider).PDF; Config: *; ComponentLink1Description: Datasheet; ComponentLink2Description: Datasheet Boitier; Value: MIC4426YM

## Sheet SC941C_Borniers.SchDoc: Borniers
size 393 x 270 mm; CompanyName: Seccom; Address1: 521, rue du capt. François Garbit; Address2: 69440 Mornant; Address3: seccom@seccom.fr; Address4: www.seccom.fr; DocumentNumber: 9; SheetNumber: 9; SheetTotal: 9; PageSetup: Record=PageOptions|CenterHorizontal=True|CenterVertical=True|PrintScale=0.74|XCorrection=1.00|YCorrection=1.00|PrintKind=0|BorderSize=5000000|LeftOffset=0|BottomOffset=0|Orientation=2|PaperLength=1000|PaperWidth=1000|Scale=100|PaperSource=7|PrintQuality=-4|MediaType=1|DitherType=10|PaperKind=A4|PrintScaleMode=1
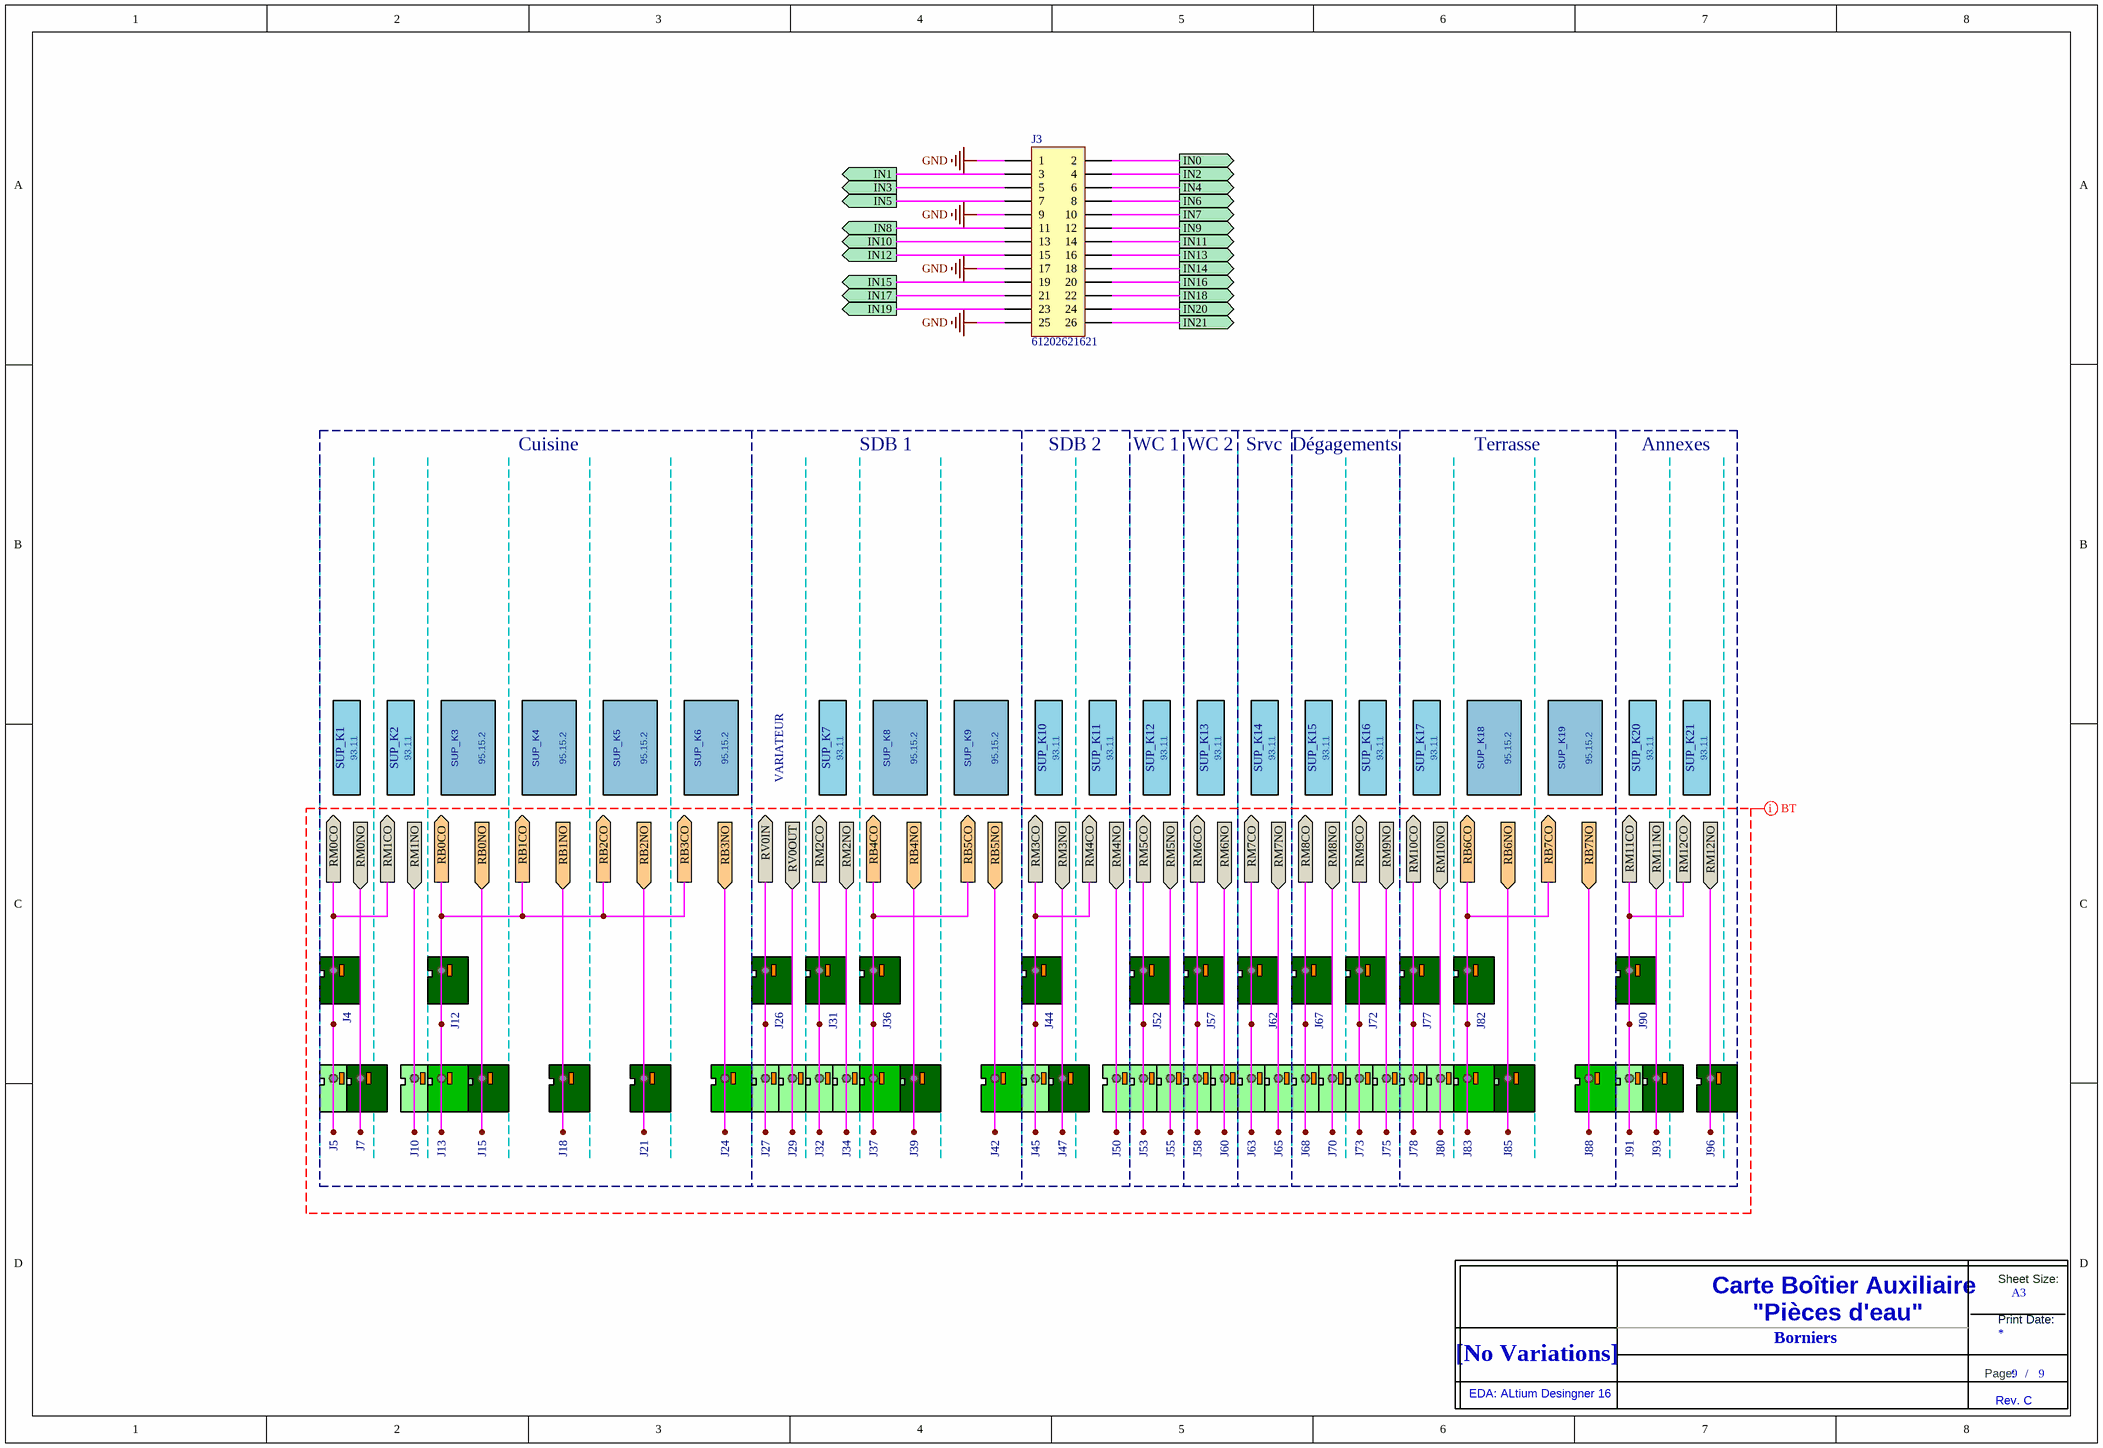
[diagram p9: SC941C_Borniers.SchDoc]

### Parts
(Parts that share a designator on the sheet are numbered #1, #2 ... from top to bottom, then left to right.)
J3  61202621621  [IDC2P54_26P]
J4  BRESS_CI_D_7.62_01_FFKDSA1/V2  [BRESS_FFKDSA1/V2-7,62_P1.3]  (value not drawn)
J5  BRESS_CI_D_5.08_01_FFKDS/V2  [BRESS_FFKDS/V2-5,08_P1.3]  (value not drawn)
J7  BRESS_CI_D_7.62_01_FFKDSA1/V2  [BRESS_FFKDSA1/V2-7,62_P1.3]  (value not drawn)
J10  BRESS_CI_D_5.08_01_FFKDS/V2  [BRESS_FFKDS/V2-5,08_P1.3]  (value not drawn)
J12  BRESS_CI_D_7.62_01_FFKDSA1/V2  [BRESS_FFKDSA1/V2-7,62_P1.3]  (value not drawn)
J13  BRESS_CI_D_7.62_01_FFKDSA/V2  [BRESS_FFKDSA/V2-7,62_P1.3]  (value not drawn)
J15  BRESS_CI_D_7.62_01_FFKDSA1/V2  [BRESS_FFKDSA1/V2-7,62_P1.3]  (value not drawn)
J18  BRESS_CI_D_7.62_01_FFKDSA1/V2  [BRESS_FFKDSA1/V2-7,62_P1.3]  (value not drawn)
J21  BRESS_CI_D_7.62_01_FFKDSA1/V2  [BRESS_FFKDSA1/V2-7,62_P1.3]  (value not drawn)
J24  BRESS_CI_D_7.62_01_FFKDSA/V2  [BRESS_FFKDSA/V2-7,62_P1.3]  (value not drawn)
J26  BRESS_CI_D_7.62_01_FFKDSA1/V2  [BRESS_FFKDSA1/V2-7,62_P1.3]  (value not drawn)
J27  BRESS_CI_D_5.08_01_FFKDS/V2  [BRESS_FFKDS/V2-5,08_P1.3]  (value not drawn)
J29  BRESS_CI_D_5.08_01_FFKDS/V2  [BRESS_FFKDS/V2-5,08_P1.3]  (value not drawn)
J31  BRESS_CI_D_7.62_01_FFKDSA1/V2  [BRESS_FFKDSA1/V2-7,62_P1.3]  (value not drawn)
J32  BRESS_CI_D_5.08_01_FFKDS/V2  [BRESS_FFKDS/V2-5,08_P1.3]  (value not drawn)
J34  BRESS_CI_D_5.08_01_FFKDS/V2  [BRESS_FFKDS/V2-5,08_P1.3]  (value not drawn)
J36  BRESS_CI_D_7.62_01_FFKDSA1/V2  [BRESS_FFKDSA1/V2-7,62_P1.3]  (value not drawn)
J37  BRESS_CI_D_7.62_01_FFKDSA/V2  [BRESS_FFKDSA/V2-7,62_P1.3]  (value not drawn)
J39  BRESS_CI_D_7.62_01_FFKDSA1/V2  [BRESS_FFKDSA1/V2-7,62_P1.3]  (value not drawn)
J42  BRESS_CI_D_7.62_01_FFKDSA/V2  [BRESS_FFKDSA/V2-7,62_P1.3]  (value not drawn)
J44  BRESS_CI_D_7.62_01_FFKDSA1/V2  [BRESS_FFKDSA1/V2-7,62_P1.3]  (value not drawn)
J45  BRESS_CI_D_5.08_01_FFKDS/V2  [BRESS_FFKDS/V2-5,08_P1.3]  (value not drawn)
J47  BRESS_CI_D_7.62_01_FFKDSA1/V2  [BRESS_FFKDSA1/V2-7,62_P1.3]  (value not drawn)
J50  BRESS_CI_D_5.08_01_FFKDS/V2  [BRESS_FFKDS/V2-5,08_P1.3]  (value not drawn)
J52  BRESS_CI_D_7.62_01_FFKDSA1/V2  [BRESS_FFKDSA1/V2-7,62_P1.3]  (value not drawn)
J53  BRESS_CI_D_5.08_01_FFKDS/V2  [BRESS_FFKDS/V2-5,08_P1.3]  (value not drawn)
J55  BRESS_CI_D_5.08_01_FFKDS/V2  [BRESS_FFKDS/V2-5,08_P1.3]  (value not drawn)
J57  BRESS_CI_D_7.62_01_FFKDSA1/V2  [BRESS_FFKDSA1/V2-7,62_P1.3]  (value not drawn)
J58  BRESS_CI_D_5.08_01_FFKDS/V2  [BRESS_FFKDS/V2-5,08_P1.3]  (value not drawn)
J60  BRESS_CI_D_5.08_01_FFKDS/V2  [BRESS_FFKDS/V2-5,08_P1.3]  (value not drawn)
J62  BRESS_CI_D_7.62_01_FFKDSA1/V2  [BRESS_FFKDSA1/V2-7,62_P1.3]  (value not drawn)
J63  BRESS_CI_D_5.08_01_FFKDS/V2  [BRESS_FFKDS/V2-5,08_P1.3]  (value not drawn)
J65  BRESS_CI_D_5.08_01_FFKDS/V2  [BRESS_FFKDS/V2-5,08_P1.3]  (value not drawn)
J67  BRESS_CI_D_7.62_01_FFKDSA1/V2  [BRESS_FFKDSA1/V2-7,62_P1.3]  (value not drawn)
J68  BRESS_CI_D_5.08_01_FFKDS/V2  [BRESS_FFKDS/V2-5,08_P1.3]  (value not drawn)
J70  BRESS_CI_D_5.08_01_FFKDS/V2  [BRESS_FFKDS/V2-5,08_P1.3]  (value not drawn)
J72  BRESS_CI_D_7.62_01_FFKDSA1/V2  [BRESS_FFKDSA1/V2-7,62_P1.3]  (value not drawn)
J73  BRESS_CI_D_5.08_01_FFKDS/V2  [BRESS_FFKDS/V2-5,08_P1.3]  (value not drawn)
J75  BRESS_CI_D_5.08_01_FFKDS/V2  [BRESS_FFKDS/V2-5,08_P1.3]  (value not drawn)
J77  BRESS_CI_D_7.62_01_FFKDSA1/V2  [BRESS_FFKDSA1/V2-7,62_P1.3]  (value not drawn)
J78  BRESS_CI_D_5.08_01_FFKDS/V2  [BRESS_FFKDS/V2-5,08_P1.3]  (value not drawn)
J80  BRESS_CI_D_5.08_01_FFKDS/V2  [BRESS_FFKDS/V2-5,08_P1.3]  (value not drawn)
J82  BRESS_CI_D_7.62_01_FFKDSA1/V2  [BRESS_FFKDSA1/V2-7,62_P1.3]  (value not drawn)
J83  BRESS_CI_D_7.62_01_FFKDSA/V2  [BRESS_FFKDSA/V2-7,62_P1.3]  (value not drawn)
J85  BRESS_CI_D_7.62_01_FFKDSA1/V2  [BRESS_FFKDSA1/V2-7,62_P1.3]  (value not drawn)
J88  BRESS_CI_D_7.62_01_FFKDSA/V2  [BRESS_FFKDSA/V2-7,62_P1.3]  (value not drawn)
J90  BRESS_CI_D_7.62_01_FFKDSA1/V2  [BRESS_FFKDSA1/V2-7,62_P1.3]  (value not drawn)
J91  BRESS_CI_D_5.08_01_FFKDS/V2  [BRESS_FFKDS/V2-5,08_P1.3]  (value not drawn)
J93  BRESS_CI_D_7.62_01_FFKDSA1/V2  [BRESS_FFKDSA1/V2-7,62_P1.3]  (value not drawn)
J96  BRESS_CI_D_7.62_01_FFKDSA1/V2  [BRESS_FFKDSA1/V2-7,62_P1.3]  (value not drawn)
SUP_K1  value 93.11  [RELAY-SUPPORT_FINDER_SERIE93]  (hidden comment: RELAY-SUPPORT_93.11)
SUP_K2  value 93.11  [RELAY-SUPPORT_FINDER_SERIE93]  (hidden comment: RELAY-SUPPORT_93.11)
SUP_K3  value 95.15.2  [RELAY-SUPPORT_FINDER_SERIE95]  (hidden comment: RELAY-SUPPORT_95.15.2)
SUP_K4  value 95.15.2  [RELAY-SUPPORT_FINDER_SERIE95]  (hidden comment: RELAY-SUPPORT_95.15.2)
SUP_K5  value 95.15.2  [RELAY-SUPPORT_FINDER_SERIE95]  (hidden comment: RELAY-SUPPORT_95.15.2)
SUP_K6  value 95.15.2  [RELAY-SUPPORT_FINDER_SERIE95]  (hidden comment: RELAY-SUPPORT_95.15.2)
SUP_K7  value 93.11  [RELAY-SUPPORT_FINDER_SERIE93]  (hidden comment: RELAY-SUPPORT_93.11)
SUP_K8  value 95.15.2  [RELAY-SUPPORT_FINDER_SERIE95]  (hidden comment: RELAY-SUPPORT_95.15.2)
SUP_K9  value 95.15.2  [RELAY-SUPPORT_FINDER_SERIE95]  (hidden comment: RELAY-SUPPORT_95.15.2)
SUP_K10  value 93.11  [RELAY-SUPPORT_FINDER_SERIE93]  (hidden comment: RELAY-SUPPORT_93.11)
SUP_K11  value 93.11  [RELAY-SUPPORT_FINDER_SERIE93]  (hidden comment: RELAY-SUPPORT_93.11)
SUP_K12  value 93.11  [RELAY-SUPPORT_FINDER_SERIE93]  (hidden comment: RELAY-SUPPORT_93.11)
SUP_K13  value 93.11  [RELAY-SUPPORT_FINDER_SERIE93]  (hidden comment: RELAY-SUPPORT_93.11)
SUP_K14  value 93.11  [RELAY-SUPPORT_FINDER_SERIE93]  (hidden comment: RELAY-SUPPORT_93.11)
SUP_K15  value 93.11  [RELAY-SUPPORT_FINDER_SERIE93]  (hidden comment: RELAY-SUPPORT_93.11)
SUP_K16  value 93.11  [RELAY-SUPPORT_FINDER_SERIE93]  (hidden comment: RELAY-SUPPORT_93.11)
SUP_K17  value 93.11  [RELAY-SUPPORT_FINDER_SERIE93]  (hidden comment: RELAY-SUPPORT_93.11)
SUP_K18  value 95.15.2  [RELAY-SUPPORT_FINDER_SERIE95]  (hidden comment: RELAY-SUPPORT_95.15.2)
SUP_K19  value 95.15.2  [RELAY-SUPPORT_FINDER_SERIE95]  (hidden comment: RELAY-SUPPORT_95.15.2)
SUP_K20  value 93.11  [RELAY-SUPPORT_FINDER_SERIE93]  (hidden comment: RELAY-SUPPORT_93.11)
SUP_K21  value 93.11  [RELAY-SUPPORT_FINDER_SERIE93]  (hidden comment: RELAY-SUPPORT_93.11)
Title_new#9  DNI  (value not drawn)  (graphical)

### Ports
IN0 (out), IN1 (out), IN2 (out), IN3 (out), IN4 (out), IN5 (out), IN6 (out), IN7 (out), IN8 (out), IN9 (out), IN10 (out), IN11 (out), IN12 (out), IN13 (out), IN14 (out), IN15 (out), IN16 (out), IN17 (out), IN18 (out), IN19 (out), IN20 (out), IN21 (out), RB0CO (out), RB0NO (in), RB1CO (out), RB1NO (in), RB2CO (out), RB2NO (in), RB3CO (out), RB3NO (in), RB4CO (out), RB4NO (in), RB5CO (out), RB5NO (in), RB6CO (out), RB6NO (in), RB7CO (out), RB7NO (in), RM0CO (out), RM0NO (in), RM1CO (out), RM1NO (in), RM2CO (out), RM2NO (in), RM3CO (out), RM3NO (in), RM4CO (out), RM4NO (in), RM5CO (out), RM5NO (in), RM6CO (out), RM6NO (in), RM7CO (out), RM7NO (in), RM8CO (out), RM8NO (in), RM9CO (out), RM9NO (in), RM10CO (out), RM10NO (in), RM11CO (out), RM11NO (in), RM12CO (out), RM12NO (in), RV0IN (out), RV0OUT (in)

### Nets
GND: J3.1 J3.9 J3.17 J3.25
IN0: J3.2 ; port IN0
IN1: J3.3 ; port IN1
IN2: J3.4 ; port IN2
IN3: J3.5 ; port IN3
IN4: J3.6 ; port IN4
IN5: J3.7 ; port IN5
IN6: J3.8 ; port IN6
IN7: J3.10 ; port IN7
IN8: J3.11 ; port IN8
IN9: J3.12 ; port IN9
IN10: J3.13 ; port IN10
IN11: J3.14 ; port IN11
IN12: J3.15 ; port IN12
IN13: J3.16 ; port IN13
IN14: J3.18 ; port IN14
IN15: J3.19 ; port IN15
IN16: J3.20 ; port IN16
IN17: J3.21 ; port IN17
IN18: J3.22 ; port IN18
IN19: J3.23 ; port IN19
IN20: J3.24 ; port IN20
IN21: J3.26 ; port IN21
RB0CO: J12.1 J12.2 J13.1 J13.2 ; port RB2CO, port RB0CO, port RB1CO, port RB3CO
RB0NO: J15.1 J15.2 ; port RB0NO
RB1NO: J18.1 J18.2 ; port RB1NO
RB2NO: J21.1 J21.2 ; port RB2NO
RB3NO: J24.1 J24.2 ; port RB3NO
RB4CO: J36.1 J36.2 J37.1 J37.2 ; port RB4CO, port RB5CO
RB4NO: J39.1 J39.2 ; port RB4NO
RB5NO: J42.1 J42.2 ; port RB5NO
RB6CO: J82.1 J82.2 J83.1 J83.2 ; port RB6CO, port RB7CO
RB6NO: J85.1 J85.2 ; port RB6NO
RB7NO: J88.1 J88.2 ; port RB7NO
RM0CO: J4.1 J4.2 J5.1 J5.2 ; port RM0CO, port RM1CO
RM0NO: J7.1 J7.2 ; port RM0NO
RM1NO: J10.1 J10.2 ; port RM1NO
RM2CO: J31.1 J31.2 J32.1 J32.2 ; port RM2CO
RM2NO: J34.1 J34.2 ; port RM2NO
RM3CO: J44.1 J44.2 J45.1 J45.2 ; port RM4CO, port RM3CO
RM3NO: J47.1 J47.2 ; port RM3NO
RM4NO: J50.1 J50.2 ; port RM4NO
RM5CO: J52.1 J52.2 J53.1 J53.2 ; port RM5CO
RM5NO: J55.1 J55.2 ; port RM5NO
RM6CO: J57.1 J57.2 J58.1 J58.2 ; port RM6CO
RM6NO: J60.1 J60.2 ; port RM6NO
RM7CO: J62.1 J62.2 J63.1 J63.2 ; port RM7CO
RM7NO: J65.1 J65.2 ; port RM7NO
RM8CO: J67.1 J67.2 J68.1 J68.2 ; port RM8CO
RM8NO: J70.1 J70.2 ; port RM8NO
RM9CO: J72.1 J72.2 J73.1 J73.2 ; port RM9CO
RM9NO: J75.1 J75.2 ; port RM9NO
RM10CO: J77.1 J77.2 J78.1 J78.2 ; port RM10CO
RM10NO: J80.1 J80.2 ; port RM10NO
RM11CO: J90.1 J90.2 J91.1 J91.2 ; port RM12CO, port RM11CO
RM11NO: J93.1 J93.2 ; port RM11NO
RM12NO: J96.1 J96.2 ; port RM12NO
RV0IN: J26.1 J26.2 J27.1 J27.2 ; port RV0IN
RV0OUT: J29.1 J29.2 ; port RV0OUT

### Layout directives
net class BT: (no net found under the mark)

### Notes on the sheet
- Cuisine
- SDB 1
- SDB 2
- WC 1
- WC 2
- Srvc
- Dégagements
- Terrasse
- Annexes
- VARIATEUR
- Borniers
- (in symbol Title_new) Sheet Size:; Carte Boîtier Auxiliaire; A3; "Pièces d'eau"; Print Date:; [No Variations]; Page:; /; EDA: ALtium Desingner 16; Rev. C

### Library data of the parts
J3 = Header 13X2: 26 Positions Header, Shrouded Connector 0.100" (2.54mm) Through Hole Gold; Manufacturer: Wurth Electronics Inc; Fabricant: Wurth Elektronik; Supplier 1: Digi-Key; Supplier Part Number 1: 732-2097-ND; Manufacturer Part Number: 61202621621; Ref Fab: 61202621621; Value: 61202621621
J4 J7 J12 J15 J18 J21 J26 J31 J36 J39 J44 J47 J52 J57 J62 J67 J72 J77 J82 J85 J90 J93 J96 = BRESS_CI_D_7.62_01_FFKDSA1/V2: Bornier à connexion par ressorts/déconnexion par levier, série FFKDSA1/V2, e7.62, 1x1pts, droit, juxtaposable, 500V/17.5A, AWG22~16, Vert/Orange; Creation: LJ (21/11/11); Boitier: 7.62x10_h15.8_e7.62_p1.3mm; Remarque: {Remarque}; Fabricant: Phoenix Contact; Ref Fab: 1790487; Coeff: 1; Value: FFKDSA1/V2-7,62; Verification: *; ComponentLink1URL: o:\_Documentation\Datasheets\Phoenix\FFKDSA1-V2_7,62_1790487.pdf; ComponentLink2URL: o:\_Documentation\Datasheets\_BOITIERS\; Config: *; ComponentLink1Description: Datasheet; ComponentLink2Description: Datasheet
J5 J10 J27 J29 J32 J34 J45 J50 J53 J55 J58 J60 J63 J65 J68 J70 J73 J75 J78 J80 J91 = BRESS_CI_D_5.08_01_FFKDS/V2: Bornier à connexion par ressorts/déconnexion par levier, série FFKDS/V2, e5.08, 1x1pts, droit, juxtaposable, 320V/15A, AWG22~16, Vert/Orange; Creation: LJ (21/11/11); Boitier: 5.08x10_h15.8_e5.08_p1.3mm; Remarque: {Remarque}; Fabricant: Phoenix Contact; Ref Fab: 1790348; Coeff: 1; Value: FFKDS/V2-5,08; Verification: *; ComponentLink1URL: o:\_Documentation\Datasheets\Phoenix\FFKDS-V2_5,08_1790348.pdf; ComponentLink2URL: o:\_Documentation\Datasheets\_BOITIERS\; Config: *; ComponentLink1Description: Datasheet; ComponentLink2Description: Datasheet
J13 J24 J37 J42 J83 J88 = BRESS_CI_D_7.62_01_FFKDSA/V2: Bornier à connexion par ressorts/déconnexion par levier, série FFKDSA/V2, e7.62, 1x1pts, droit, juxtaposable, 500V/17.5A, AWG22~16, Vert/Orange; Creation: LJ (21/11/11); Boitier: 7.62x10_h15.8_e7.62_p1.3mm; Remarque: {Remarque}; Fabricant: Phoenix Contact; Ref Fab: 1790377; Coeff: 1; Value: FFKDSA/V2-7,62; Verification: *; ComponentLink1URL: o:\_Documentation\Datasheets\Phoenix\FFKDSA-V2_7,62_1790377.pdf; ComponentLink2URL: o:\_Documentation\Datasheets\_BOITIERS\; Config: *; ComponentLink1Description: Datasheet; ComponentLink2Description: Datasheet
SUP_K1 SUP_K2 SUP_K7 SUP_K10-SUP_K17 SUP_K20 SUP_K21 = RELAY-SUPPORT_93.11: Suppor série 93 pour relais Finder séries 34, 250V/6A, Bleu; Creation: LJ (24/11/11); Remarque: {Remarque}; Coeff: 1; Fabricant: Finder; Ref Fab: 93.11; ComponentLink1URL: o:\_Documentation\Datasheets\Finder\Relais_Serie_34.pdf; ComponentLink2URL: o:\_Documentation\Datasheets\; Config: *; ComponentLink1Description: Datasheet; ComponentLink2Description: Datasheet Boitier
SUP_K3-SUP_K6 SUP_K8 SUP_K9 SUP_K18 SUP_K19 = RELAY-SUPPORT_95.15.2: Suppor série 95 pour relais Finder séries 40, 250V/10A, Bleu, sans Etrier; Creation: LJ (11/06/12); Remarque: {Remarque}; Coeff: 1; Fabricant: Finder; Ref Fab: 95.15.2; ComponentLink1URL: o:\_Documentation\Datasheets\Finder\Relais_Serie_40.pdf; ComponentLink2URL: o:\_Documentation\Datasheets\; Config: *; ComponentLink1Description: Datasheet; ComponentLink2Description: Datasheet Boitier
Title_new#9 = Title_new

## Nets that join several sheets
+5V: SC941C_Coeur (17 pins), SC941C_Variateurs (C15.1 U2.1UC), SC941C_STORRB (R70.2 R71.2)
+12V: SC941C_Coeur (6 pins), SC941C_ETOR1 (12 pins), SC941C_ETOR2 (10 pins), SC941C_STORRM1 (16 pins), SC941C_STORRM2 (10 pins), SC941C_STORRB (11 pins)
GND: SC941C_Coeur (30 pins), SC941C_ETOR1 (36 pins), SC941C_ETOR2 (30 pins), SC941C_STORRM1 (16 pins), SC941C_STORRM2 (10 pins), SC941C_Variateurs (C15.2 U2.3UC), SC941C_STORRB (C38.2 C39.1 U5.3), SC941C_Borniers (J3.1 J3.9 J3.17 J3.25)
IN0: SC941C_ETOR1 (D11.K R9.1 R12.1 R13.2), SC941C_Borniers (J3.2)
IN0_UC: SC941C_Coeur (U4.15), SC941C_ETOR1 (C6.2 R12.2)
IN1: SC941C_ETOR1 (D13.K R15.1 R18.1 R19.2), SC941C_Borniers (J3.3)
IN1_UC: SC941C_Coeur (U4.14), SC941C_ETOR1 (C8.2 R18.2)
IN2: SC941C_ETOR1 (D16.K R23.1 R24.2 R25.1), SC941C_Borniers (J3.4)
IN2_UC: SC941C_Coeur (U4.13), SC941C_ETOR1 (C10.2 R23.2)
IN3: SC941C_ETOR1 (D19.K R27.1 R30.1 R31.2), SC941C_Borniers (J3.5)
IN3_UC: SC941C_Coeur (U4.12), SC941C_ETOR1 (C12.2 R30.2)
IN4: SC941C_ETOR1 (D10.K R8.1 R10.1 R11.2), SC941C_Borniers (J3.6)
IN4_UC: SC941C_Coeur (U4.11), SC941C_ETOR1 (C5.2 R10.2)
IN5: SC941C_ETOR1 (D12.K R14.1 R16.1 R17.2), SC941C_Borniers (J3.7)
IN5_UC: SC941C_Coeur (U4.8), SC941C_ETOR1 (C7.2 R16.2)
IN6: SC941C_ETOR1 (D15.K R20.1 R21.1 R22.2), SC941C_Borniers (J3.8)
IN6_UC: SC941C_Coeur (U4.7), SC941C_ETOR1 (C9.2 R21.2)
IN7: SC941C_ETOR1 (D18.K R26.1 R28.1 R29.2), SC941C_Borniers (J3.10)
IN7_UC: SC941C_Coeur (U4.6), SC941C_ETOR1 (C11.2 R28.2)
IN8: SC941C_ETOR1 (D20.K R32.1 R33.1 R34.2), SC941C_Borniers (J3.11)
IN8_UC: SC941C_Coeur (U4.5), SC941C_ETOR1 (C13.2 R33.2)
IN9: SC941C_ETOR1 (D22.K R35.1 R36.1 R37.2), SC941C_Borniers (J3.12)
IN9_UC: SC941C_Coeur (U4.4), SC941C_ETOR1 (C14.2 R35.2)
IN10: SC941C_ETOR1 (D23.K R38.1 R40.1 R41.2), SC941C_Borniers (J3.13)
IN10_UC: SC941C_Coeur (U4.3), SC941C_ETOR1 (C16.2 R40.2)
IN11: SC941C_ETOR1 (D29.K R46.2 R47.1 R49.1), SC941C_Borniers (J3.14)
IN11_UC: SC941C_Coeur (U4.2), SC941C_ETOR1 (C27.2 R47.2)
IN12: SC941C_ETOR2 (D31.K R50.2 R51.1 R53.1), SC941C_Borniers (J3.15)
IN12_UC: SC941C_Coeur (U4.1), SC941C_ETOR2 (C28.2 R51.2)
IN13: SC941C_ETOR2 (D33.K R54.2 R55.1 R57.1), SC941C_Borniers (J3.16)
IN13_UC: SC941C_Coeur (U4.64), SC941C_ETOR2 (C29.2 R55.2)
IN14: SC941C_ETOR2 (D35.K R58.2 R59.1 R61.1), SC941C_Borniers (J3.18)
IN14_UC: SC941C_Coeur (U4.63), SC941C_ETOR2 (C30.2 R59.2)
IN15: SC941C_ETOR2 (D37.K R62.2 R64.1 R65.1), SC941C_Borniers (J3.19)
IN15_UC: SC941C_Coeur (U4.60), SC941C_ETOR2 (C31.2 R64.2)
IN16: SC941C_ETOR2 (D39.K R67.2 R68.1 R69.1), SC941C_Borniers (J3.20)
IN16_UC: SC941C_Coeur (U4.59), SC941C_ETOR2 (C32.2 R68.2)
IN17: SC941C_ETOR2 (D41.K R73.2 R74.1 R75.1), SC941C_Borniers (J3.21)
IN17_UC: SC941C_Coeur (U4.53), SC941C_ETOR2 (C33.2 R74.2)
IN18: SC941C_ETOR2 (D43.K R76.2 R77.1 R78.1), SC941C_Borniers (J3.22)
IN18_UC: SC941C_Coeur (U4.52), SC941C_ETOR2 (C34.2 R77.2)
IN19: SC941C_ETOR2 (D45.K R79.2 R80.1 R81.1), SC941C_Borniers (J3.23)
IN19_UC: SC941C_Coeur (U4.51), SC941C_ETOR2 (C35.2 R80.2)
IN20: SC941C_ETOR2 (D46.K R82.2 R83.1 R84.1), SC941C_Borniers (J3.24)
IN20_UC: SC941C_Coeur (U4.50), SC941C_ETOR2 (C36.2 R83.2)
IN21: SC941C_ETOR2 (D48.K R86.2 R87.1 R88.1), SC941C_Borniers (J3.26)
IN21_UC: SC941C_Coeur (U4.49), SC941C_ETOR2 (C37.2 R87.2)
RB0_UC: SC941C_Coeur (U4.18), SC941C_STORRB (T3.1 T4.1)
RB0CO: SC941C_STORRB (8 pins), SC941C_Borniers (J12.1 J12.2 J13.1 J13.2)
RB0NO: SC941C_STORRB (K3.14 K3.24), SC941C_Borniers (J15.1 J15.2)
RB1_UC: SC941C_Coeur (U4.21), SC941C_STORRB (T5.1 T6.1)
RB1NO: SC941C_STORRB (K4.14 K4.24), SC941C_Borniers (J18.1 J18.2)
RB2_UC: SC941C_Coeur (U4.22), SC941C_STORRB (T7.1 T8.1)
RB2NO: SC941C_STORRB (K5.14 K5.24), SC941C_Borniers (J21.1 J21.2)
RB3_UC: SC941C_Coeur (U4.34), SC941C_STORRB (T9.1 T10.1)
RB3NO: SC941C_STORRB (K6.14 K6.24), SC941C_Borniers (J24.1 J24.2)
RB4_UC: SC941C_Coeur (U4.37), SC941C_STORRB (T12.1 T13.1)
RB4CO: SC941C_STORRB (K8.11 K8.21 K9.11 K9.21), SC941C_Borniers (J36.1 J36.2 J37.1 J37.2)
RB4NO: SC941C_STORRB (K8.14 K8.24), SC941C_Borniers (J39.1 J39.2)
RB5_UC: SC941C_Coeur (U4.42), SC941C_STORRB (T14.1 T15.1)
RB5NO: SC941C_STORRB (K9.14 K9.24), SC941C_Borniers (J42.1 J42.2)
RB6_UC: SC941C_Coeur (U4.44), SC941C_STORRB (T24.1 T25.1)
RB6CO: SC941C_STORRB (K18.11 K18.21 K19.11 K19.21), SC941C_Borniers (J82.1 J82.2 J83.1 J83.2)
RB6NO: SC941C_STORRB (K18.14 K18.24), SC941C_Borniers (J85.1 J85.2)
RB7_UC: SC941C_Coeur (U4.43), SC941C_STORRB (T26.1 T27.1)
RB7NO: SC941C_STORRB (K19.14 K19.24), SC941C_Borniers (J88.1 J88.2)
RBSENS1_UC: SC941C_Coeur (U4.55), SC941C_STORRB (R70.1 U5.2)
RBSENS2_UC: SC941C_Coeur (U4.54), SC941C_STORRB (R71.1 U5.4)
RM0_UC: SC941C_Coeur (U4.16), SC941C_STORRM1 (R6.2 T1.1)
RM0CO: SC941C_STORRM1 (K1.11 K2.11), SC941C_Borniers (J4.1 J4.2 J5.1 J5.2)
RM0NO: SC941C_STORRM1 (K1.14), SC941C_Borniers (J7.1 J7.2)
RM1_UC: SC941C_Coeur (U4.17), SC941C_STORRM1 (R7.2 T2.1)
RM1NO: SC941C_STORRM1 (K2.14), SC941C_Borniers (J10.1 J10.2)
RM2_UC: SC941C_Coeur (U4.35), SC941C_STORRM1 (R39.2 T11.1)
RM2CO: SC941C_STORRM1 (K7.11), SC941C_Borniers (J31.1 J31.2 J32.1 J32.2)
RM2NO: SC941C_STORRM1 (K7.14), SC941C_Borniers (J34.1 J34.2)
RM3_UC: SC941C_Coeur (U4.48), SC941C_STORRM1 (R45.2 T16.1)
RM3CO: SC941C_STORRM1 (K10.11 K11.11), SC941C_Borniers (J44.1 J44.2 J45.1 J45.2)
RM3NO: SC941C_STORRM1 (K10.14), SC941C_Borniers (J47.1 J47.2)
RM4_UC: SC941C_Coeur (U4.47), SC941C_STORRM1 (R48.2 T17.1)
RM4NO: SC941C_STORRM1 (K11.14), SC941C_Borniers (J50.1 J50.2)
RM5_UC: SC941C_Coeur (U4.46), SC941C_STORRM1 (R52.2 T18.1)
RM5CO: SC941C_STORRM1 (K12.11), SC941C_Borniers (J52.1 J52.2 J53.1 J53.2)
RM5NO: SC941C_STORRM1 (K12.14), SC941C_Borniers (J55.1 J55.2)
RM6_UC: SC941C_Coeur (U4.45), SC941C_STORRM1 (R56.2 T19.1)
RM6CO: SC941C_STORRM1 (K13.11), SC941C_Borniers (J57.1 J57.2 J58.1 J58.2)
RM6NO: SC941C_STORRM1 (K13.14), SC941C_Borniers (J60.1 J60.2)
RM7_UC: SC941C_Coeur (U4.32), SC941C_STORRM1 (R60.2 T20.1)
RM7CO: SC941C_STORRM1 (K14.11), SC941C_Borniers (J62.1 J62.2 J63.1 J63.2)
RM7NO: SC941C_STORRM1 (K14.14), SC941C_Borniers (J65.1 J65.2)
RM8_UC: SC941C_Coeur (U4.31), SC941C_STORRM2 (R63.2 T21.1)
RM8CO: SC941C_STORRM2 (K15.11), SC941C_Borniers (J67.1 J67.2 J68.1 J68.2)
RM8NO: SC941C_STORRM2 (K15.14), SC941C_Borniers (J70.1 J70.2)
RM9_UC: SC941C_Coeur (U4.30), SC941C_STORRM2 (R66.2 T22.1)
RM9CO: SC941C_STORRM2 (K16.11), SC941C_Borniers (J72.1 J72.2 J73.1 J73.2)
RM9NO: SC941C_STORRM2 (K16.14), SC941C_Borniers (J75.1 J75.2)
RM10_UC: SC941C_Coeur (U4.29), SC941C_STORRM2 (R72.2 T23.1)
RM10CO: SC941C_STORRM2 (K17.11), SC941C_Borniers (J77.1 J77.2 J78.1 J78.2)
RM10NO: SC941C_STORRM2 (K17.14), SC941C_Borniers (J80.1 J80.2)
RM11_UC: SC941C_Coeur (U4.28), SC941C_STORRM2 (R85.2 T28.1)
RM11CO: SC941C_STORRM2 (K20.11 K21.11), SC941C_Borniers (J90.1 J90.2 J91.1 J91.2)
RM11NO: SC941C_STORRM2 (K20.14), SC941C_Borniers (J93.1 J93.2)
RM12_UC: SC941C_Coeur (U4.27), SC941C_STORRM2 (R89.2 T29.1)
RM12NO: SC941C_STORRM2 (K21.14), SC941C_Borniers (J96.1 J96.2)
RV0_UC: SC941C_Coeur (U4.33), SC941C_Variateurs (U2.2UC)
RV0IN: SC941C_Variateurs (U2.1TR U2.2TR VR1.2), SC941C_Borniers (J26.1 J26.2 J27.1 J27.2)
RV0OUT: SC941C_Variateurs (U2.3TR U2.4TR VR1.1), SC941C_Borniers (J29.1 J29.2)

## Assembly variants
SC941-0B: not fitted C24 C26